# EAGLE design MOSFET_Board (EAGLE 9.1.3)

## Sheet 1 of 4
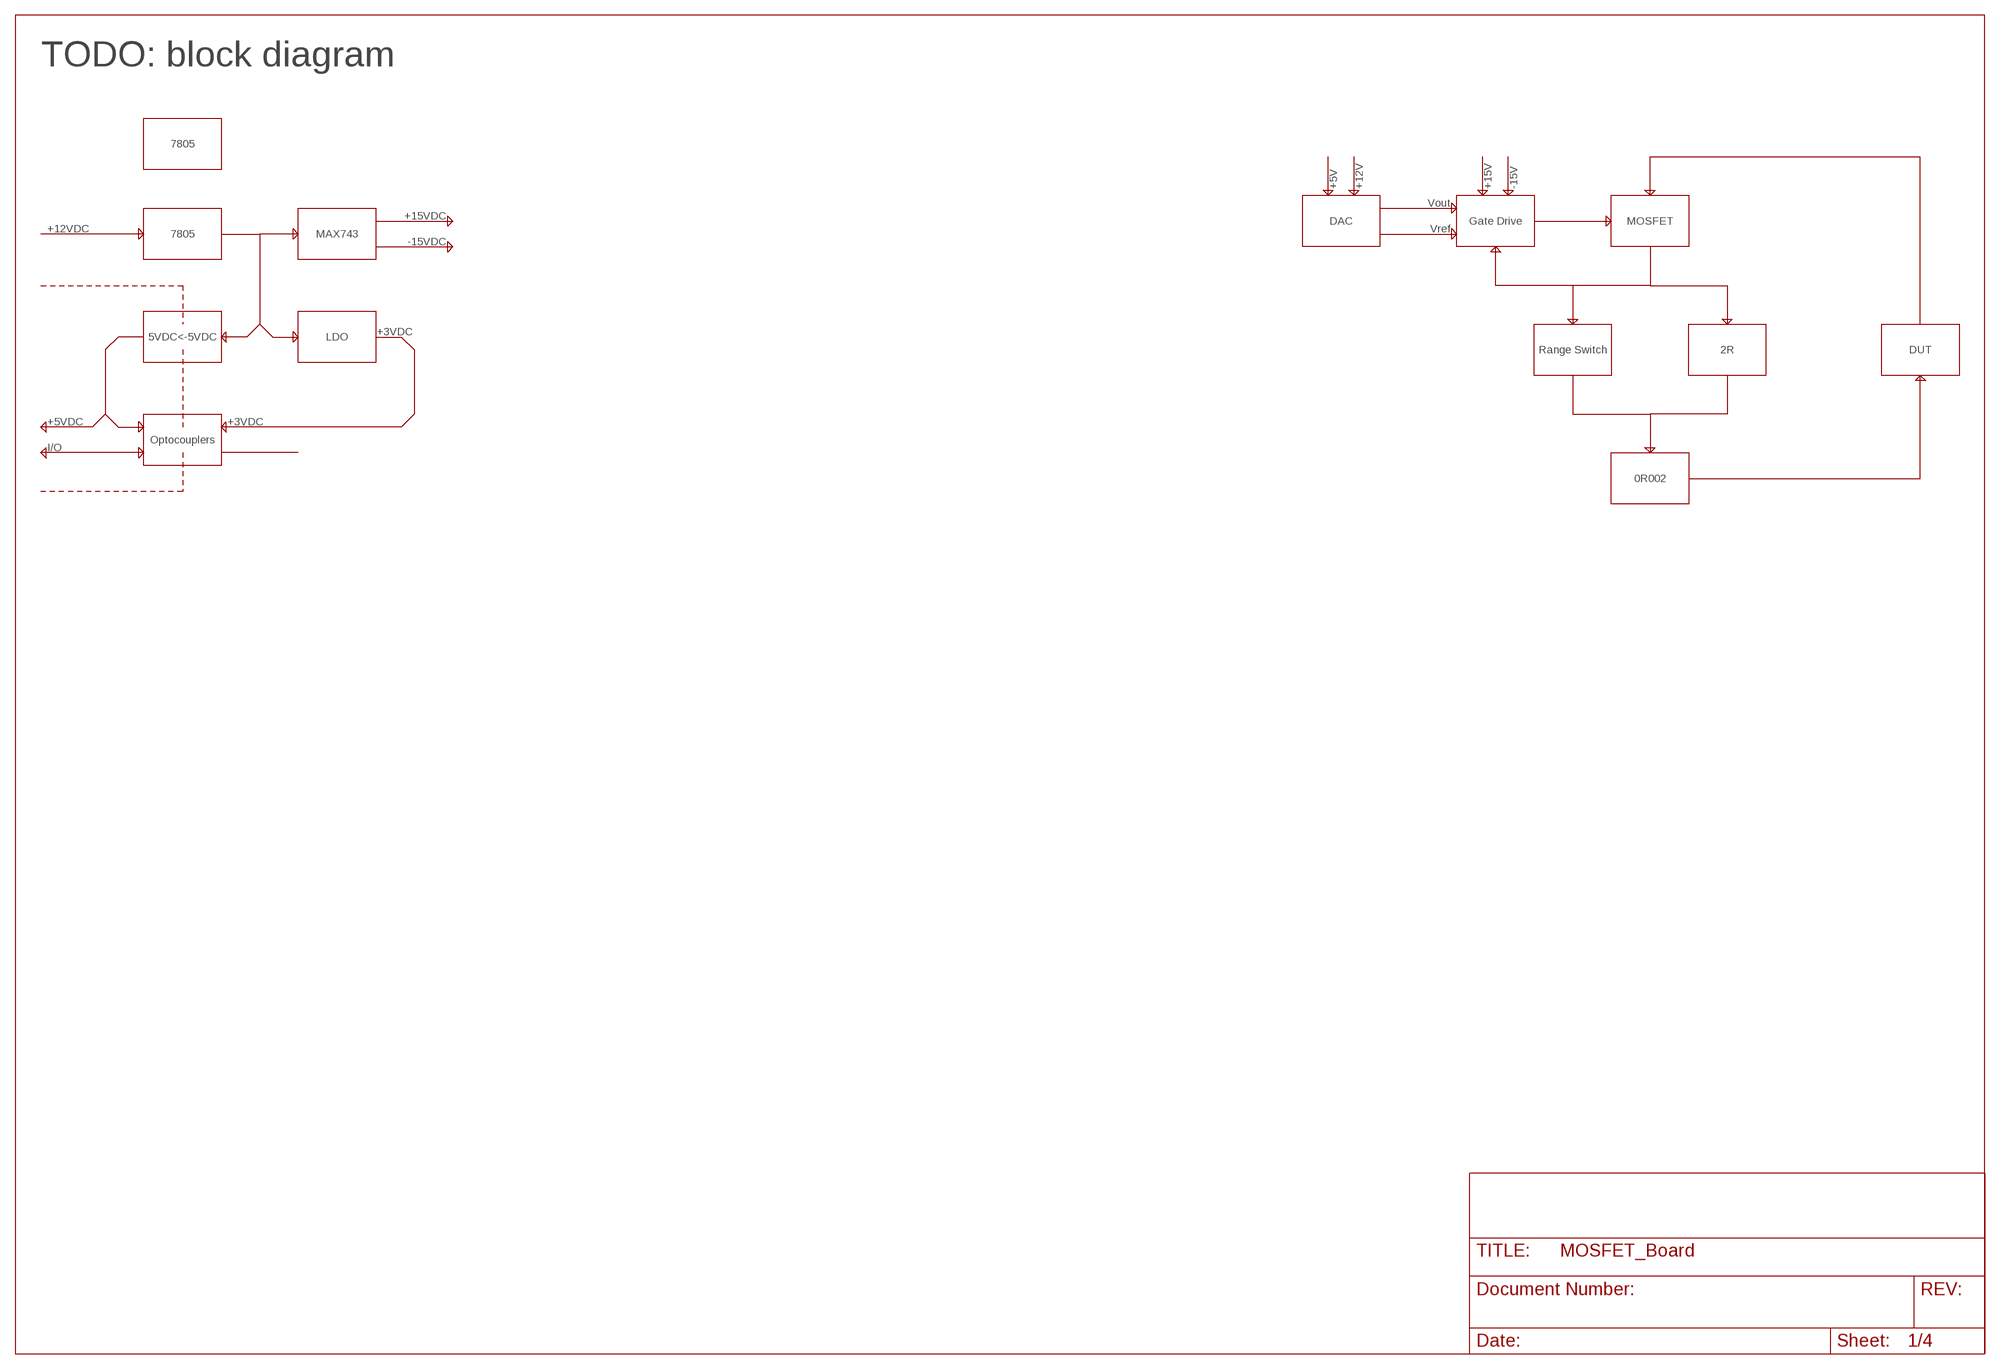
[diagram p0: schematic, sheet 1]

### Notes on the sheet
- TODO: block diagram
- 7805
- +5V | +12V | +15V | -15V
- Vout
- +15VDC | DAC | Gate Drive | MOSFET
- +12VDC | 7805 | MAX743 | Vref
- -15VDC
- 5VDC<-5VDC | LDO | +3VDC
- Range Switch | 2R | DUT
- +5VDC | +3VDC
- Optocouplers
- I/O
- 0R002

## Sheet 2 of 4
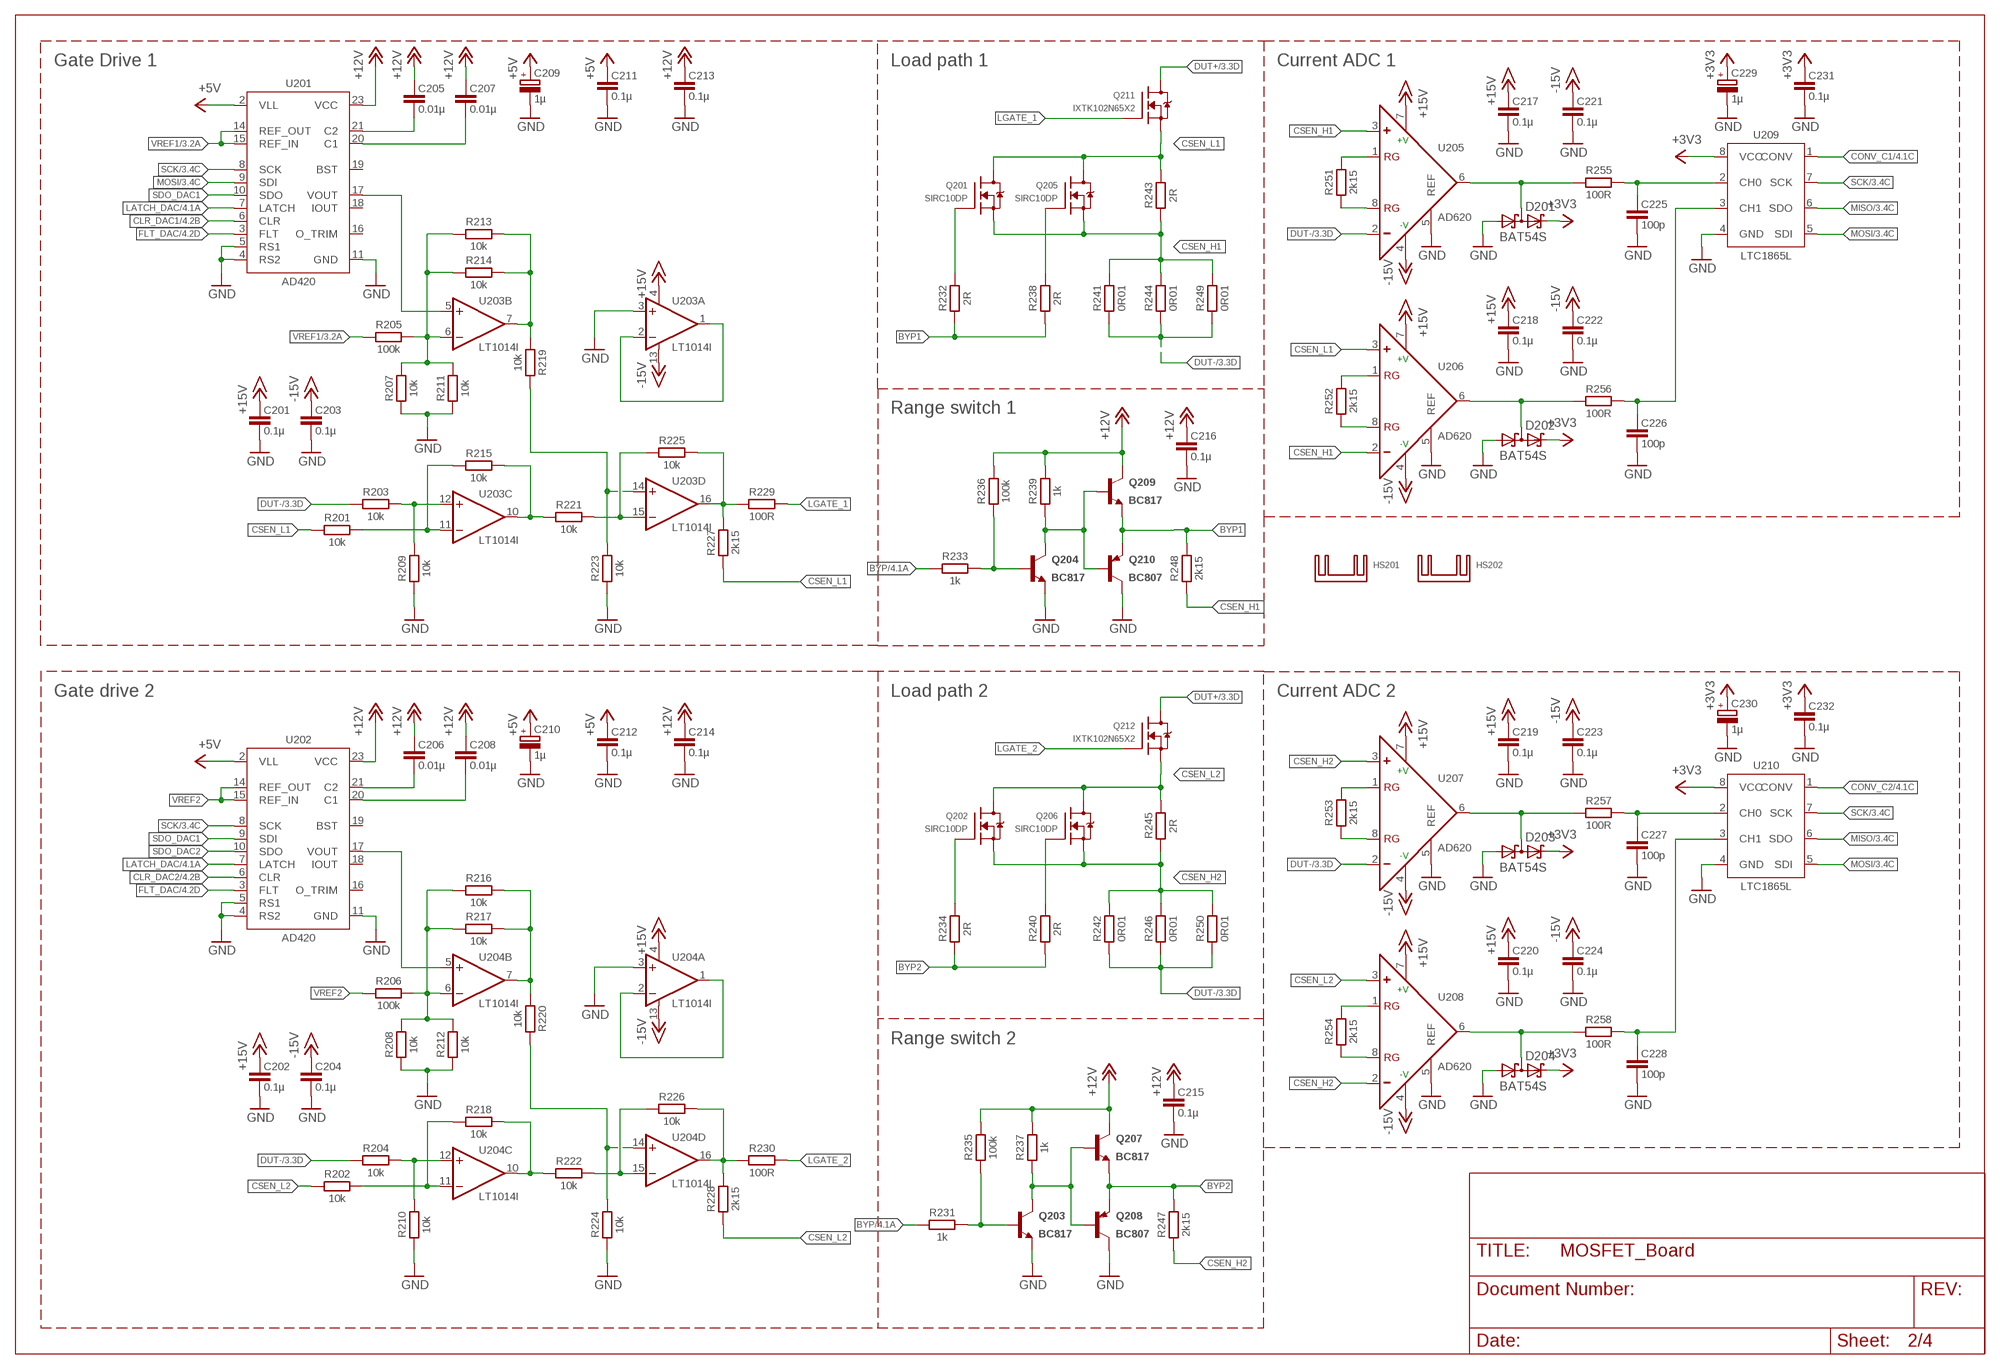
[diagram p1: schematic, sheet 2]

### Parts
C201  0.1µ  C-EU-1608  [C1608]
C202  0.1µ  C-EU-1608  [C1608]
C203  0.1µ  C-EU-1608  [C1608]
C204  0.1µ  C-EU-1608  [C1608]
C205  0.01µ  C-EU-2012  [C2012]
C206  0.01µ  C-EU-3216  [C3216]
C207  0.01µ  C-EU-2012  [C2012]
C208  0.01µ  C-EU-3216  [C3216]
C209  1µ  CPOL-3216-A  [CT3216]
C210  1µ  CPOL-3216-A  [CT3216]
C211  0.1µ  C-EU-1608  [C1608]
C212  0.1µ  C-EU-1608  [C1608]
C213  0.1µ  C-EU-1608  [C1608]
C214  0.1µ  C-EU-1608  [C1608]
C215  0.1µ  C-EU-1608  [C1608]
C216  0.1µ  C-EU-1608  [C1608]
C217  0.1µ  C-EU-1608  [C1608]
C218  0.1µ  C-EU-1608  [C1608]
C219  0.1µ  C-EU-1608  [C1608]
C220  0.1µ  C-EU-1608  [C1608]
C221  0.1µ  C-EU-1608  [C1608]
C222  0.1µ  C-EU-1608  [C1608]
C223  0.1µ  C-EU-1608  [C1608]
C224  0.1µ  C-EU-1608  [C1608]
C225  100p  C-EU-1608  [C1608]
C226  100p  C-EU-1608  [C1608]
C227  100p  C-EU-1608  [C1608]
C228  100p  C-EU-1608  [C1608]
C229  1µ  CPOL-3216-A  [CT3216]
C230  1µ  CPOL-3216-A  [CT3216]
C231  0.1µ  C-EU-1608  [C1608]
C232  0.1µ  C-EU-1608  [C1608]
D201  BAT54S  [SOT23]
D202  BAT54S  [SOT23]
D203  BAT54S  [SOT23]
D204  BAT54S  [SOT23]
HS201  HEATSINK-LGA115X  [HEATSINK-LGA115X]
HS202  HEATSINK-LGA115X  [HEATSINK-LGA115X]
Q201  SIRC10DP  [POWERPAK-SO-8]
Q202  SIRC10DP  [POWERPAK-SO-8]
Q203  BC817  [SOT23]
Q204  BC817  [SOT23]
Q205  SIRC10DP  [POWERPAK-SO-8]
Q206  SIRC10DP  [POWERPAK-SO-8]
Q207  BC817  [SOT23]
Q208  BC807  [SOT23]
Q209  BC817  [SOT23]
Q210  BC807  [SOT23]
Q211  IXTK102N65X2  IXTK102N65X2R  [TO-264P-H-PADUP]
Q212  IXTK102N65X2  IXTK102N65X2R  [TO-264P-H-PADUP]
R201  10k  R-EU-1608  [R1608]
R202  10k  R-EU-1608  [R1608]
R203  10k  R-EU-1608  [R1608]
R204  10k  R-EU-1608  [R1608]
R205  100k  R-EU-1608  [R1608]
R206  100k  R-EU-1608  [R1608]
R207  10k  R-EU-1608  [R1608]
R208  10k  R-EU-1608  [R1608]
R209  10k  R-EU-1608  [R1608]
R210  10k  R-EU-1608  [R1608]
R211  10k  R-EU-1608  [R1608]
R212  10k  R-EU-1608  [R1608]
R213  10k  R-EU-1608  [R1608]
R214  10k  R-EU-1608  [R1608]
R215  10k  R-EU-1608  [R1608]
R216  10k  R-EU-1608  [R1608]
R217  10k  R-EU-1608  [R1608]
R218  10k  R-EU-1608  [R1608]
R219  10k  R-EU-1608  [R1608]
R220  10k  R-EU-1608  [R1608]
R221  10k  R-EU-1608  [R1608]
R222  10k  R-EU-1608  [R1608]
R223  10k  R-EU-1608  [R1608]
R224  10k  R-EU-1608  [R1608]
R225  10k  R-EU-1608  [R1608]
R226  10k  R-EU-1608  [R1608]
R227  2k15  R-EU-2012  [R2012W]
R228  2k15  R-EU-2012  [R2012W]
R229  100R  R-EU-2012  [R2012W]
R230  100R  R-EU-2012  [R2012W]
R231  1k  R-EU-1608  [R1608]
R232  2R  R-EU-3216  [R3216W]
R233  1k  R-EU-1608  [R1608]
R234  2R  R-EU-3216  [R3216W]
R235  100k  R-EU-1608  [R1608]
R236  100k  R-EU-1608  [R1608]
R237  1k  R-EU-1608  [R1608]
R238  2R  R-EU-3216  [R3216W]
R239  1k  R-EU-1608  [R1608]
R240  2R  R-EU-3216  [R3216W]
R241  0R01  R-EU-6332  [R6332W]
R242  0R01  R-EU-6332  [R6332W]
R243  2R  R-EU-3216  [R3216W]
R244  0R01  R-EU-6332  [R6332W]
R245  2R  R-EU-3216  [R3216W]
R246  0R01  R-EU-6332  [R6332W]
R247  2k15  R-EU-2012  [R2012W]
R248  2k15  R-EU-2012  [R2012W]
R249  0R01  R-EU-6332  [R6332W]
R250  0R01  R-EU-6332  [R6332W]
R251  2k15  R-EU-2012  [R2012W]
R252  2k15  R-EU-2012  [R2012W]
R253  2k15  R-EU-2012  [R2012W]
R254  2k15  R-EU-2012  [R2012W]
R255  100R  R-EU-2012  [R2012W]
R256  100R  R-EU-2012  [R2012W]
R257  100R  R-EU-2012  [R2012W]
R258  100R  R-EU-2012  [R2012W]
U201  AD420  AD420RW-24  [SO24W]
U202  AD420  AD420RW-24  [SO24W]
U203  LT1014I  LT1014ISW  [SO16W]
U204  LT1014I  LT1014ISW  [SO16W]
U205  AD620  AD620R-8  [SO8]
U206  AD620  AD620R-8  [SO8]
U207  AD620  AD620R-8  [SO8]
U208  AD620  AD620R-8  [SO8]
U209  LTC1865L  [SO8]
U210  LTC1865L  [SO8]

### Nets
+3V3: C229.+ C230.+ C231.1 C232.1 D201.2(C2) D202.2(C2) D203.2(C2) D204.2(C2) U209.8(VCC) U210.8(VCC) ; also sheet 3,4
+5V: C209.+ C210.+ C211.1 C212.1 U201.2(VLL) U202.2(VLL) ; also sheet 3,4
+12V: C205.1 C206.1 C207.1 C208.1 C213.1 C214.1 C215.1 C216.1 Q207.3(C) Q209.3(C) R235.2 R236.2 R237.2 R239.2 U201.23(VCC) U202.23(VCC) ; also sheet 3
+15V: C201.1 C202.1 C217.1 C218.1 C219.1 C220.1 U203.4(A:V+) U204.4(A:V+) U205.7(+V) U206.7(+V) U207.7(+V) U208.7(+V) ; also sheet 3
-15V: C203.1 C204.1 C221.1 C222.1 C223.1 C224.1 U203.13(A:V-) U204.13(A:V-) U205.4(-V) U206.4(-V) U207.4(-V) U208.4(-V) ; also sheet 3
BPY1G1: Q201.4(G) R232.2
BYP: R231.1 R233.1 ; also sheet 4
BYP1: Q209.2(E) Q210.2(E) R232.1 R238.1 R248.1
BYP1G2: Q205.4(G) R238.2
BYP2: Q207.2(E) Q208.2(E) R234.1 R240.1 R247.2
BYP2G1: Q202.4(G) R234.2
BYP2G2: Q206.4(G) R240.2
CLR_DAC1: U201.6(CLR) ; also sheet 4
CLR_DAC2: U202.6(CLR) ; also sheet 4
CONV_C1: U209.1(CONV) ; also sheet 4
CONV_C2: U210.1(CONV) ; also sheet 4
CSEN_H1: Q201.1(S) Q201.2(S) Q201.3(S) Q205.1(S) Q205.2(S) Q205.3(S) R241.2 R243.1 R244.2 R248.2 R249.2 U205.3(+) U206.2(-)
CSEN_H2: Q202.1(S) Q202.2(S) Q202.3(S) Q206.1(S) Q206.2(S) Q206.3(S) R242.2 R245.1 R246.2 R247.1 R250.2 U207.3(+) U208.2(-)
CSEN_L1: Q201.5(D) Q205.5(D) Q211.1(S) R201.1 R227.1 R243.2 U206.3(+)
CSEN_L2: Q202.5(D) Q206.5(D) Q212.1(S) R202.1 R228.1 R245.2 U208.3(+)
DAC_VOUT: U201.17(VOUT) U203.5(B:+IN)
DAC_VOUT1: U202.17(VOUT) U204.5(B:+IN)
DUT+ [DUT+]: Q211.2(D) Q212.2(D) ; also sheet 3
DUT- [DUT-]: R203.1 R204.1 R241.1 R242.1 R244.1 R246.1 R249.1 R250.1 U205.2(-) U207.2(-) ; also sheet 3
FLT_DAC: U201.3(FLT) U202.3(FLT) ; also sheet 4
GND: C201.2 C202.2 C203.2 C204.2 C209.- C210.- C211.2 C212.2 C213.2 C214.2 C215.2 C216.2 C217.2 C218.2 C219.2 C220.2 C221.2 C222.2 C223.2 C224.2 C225.2 C226.2 C227.2 C228.2 C229.- C230.- C231.2 C232.2 D201.1(A1) D202.1(A1) D203.1(A1) D204.1(A1) Q203.2(E) Q204.2(E) Q208.3(C) Q210.3(C) R207.1 R208.1 R209.1 R210.1 R211.1 R212.1 R223.1 R224.1 U201.4(RS2) U201.5(RS1) U201.11(GND) U202.4(RS2) U202.5(RS1) U202.11(GND) U203.3(A:+IN) U204.3(A:+IN) U205.5(REF) U206.5(REF) U207.5(REF) U208.5(REF) U209.4(GND) U210.4(GND) ; also sheet 3,4
HIGHC1: C225.1 R255.2 U209.2(CH0)
HIGHC2: C227.1 R257.2 U210.2(CH0)
LATCH_DAC: U201.7(LATCH) U202.7(LATCH) ; also sheet 4
LGATE_1: Q211.3(G) R229.2
LGATE_2: Q212.3(G) R230.2
LOWC1: C226.1 R256.2 U209.3(CH1)
LOWC2: C228.1 R258.2 U210.3(CH1)
MISO: U209.6(SDO) U210.6(SDO) ; also sheet 3,4
MOSI: U201.9(SDI) U209.5(SDI) U210.5(SDI) ; also sheet 3,4
N$1: R203.2 R209.2 U203.12(C:+IN)
N$2: R221.2 R225.1 U203.15(D:-IN)
N$3: C205.2 U201.21(C2)
N$4: C207.2 U201.20(C1)
N$5: Q204.3(C) Q209.1(B) Q210.1(B) R239.1
N$6: R225.2 R227.2 R229.1 U203.16(D:OUT)
N$7: D201.3(C1A2) R255.1 U205.6(OUT)
N$8: Q204.1(B) R233.2 R236.1
N$9: R219.2 R223.2 U203.14(D:+IN)
N$11: R213.2 R214.2 R219.1 U203.7(B:OUT)
N$12: R205.2 R207.2 R211.2 R213.1 R214.1 U203.6(B:-IN)
N$13: R215.2 R221.1 U203.10(C:OUT)
N$14: R201.2 R215.1 U203.11(C:-IN)
N$15: U203.1(A:OUT) U203.2(A:-IN)
N$16: D202.3(C1A2) R256.1 U206.6(OUT)
N$25: Q203.3(C) Q207.1(B) Q208.1(B) R237.1
N$31: Q203.1(B) R231.2 R235.1
N$41: C206.2 U202.21(C2)
N$42: C208.2 U202.20(C1)
N$43: R206.2 R208.2 R212.2 R216.1 R217.1 U204.6(B:-IN)
N$44: R218.2 R222.1 U204.10(C:OUT)
N$49: R202.2 R218.1 U204.11(C:-IN)
N$50: R204.2 R210.2 U204.12(C:+IN)
N$51: R222.2 R226.1 U204.15(D:-IN)
N$52: R226.2 R228.2 R230.1 U204.16(D:OUT)
N$53: R220.2 R224.2 U204.14(D:+IN)
N$54: R216.2 R217.2 R220.1 U204.7(B:OUT)
N$55: U204.1(A:OUT) U204.2(A:-IN)
N$56: D203.3(C1A2) R257.1 U207.6(OUT)
N$57: D204.3(C1A2) R258.1 U208.6(OUT)
RG1_L1: R253.2 U207.1(RG)
RG1_L2: R254.2 U208.1(RG)
RG1_L3: R251.2 U205.1(RG)
RG1_L4: R252.2 U206.1(RG)
RG2_L1: R253.1 U207.8(RG)
RG2_L2: R254.1 U208.8(RG)
RG2_L3: R251.1 U205.8(RG)
RG2_L4: R252.1 U206.8(RG)
SCK: U201.8(SCK) U202.8(SCK) U209.7(SCK) U210.7(SCK) ; also sheet 3,4
SDO_DAC1: U201.10(SDO) U202.9(SDI)
SDO_DAC2: U202.10(SDO)
VREF1: R205.1 U201.14(REF_OUT) U201.15(REF_IN) ; also sheet 3
VREF2: R206.1 U202.14(REF_OUT) U202.15(REF_IN)
Unconnected: U201.16(O_TRIM) U201.18(IOUT) U201.19(BST) U202.16(O_TRIM) U202.18(IOUT) U202.19(BST)

### Notes on the sheet
- Gate Drive 1 | Load path 1 | Current ADC 1
- Range switch 1
- Gate drive 2 | Load path 2 | Current ADC 2
- Range switch 2

## Sheet 3 of 4
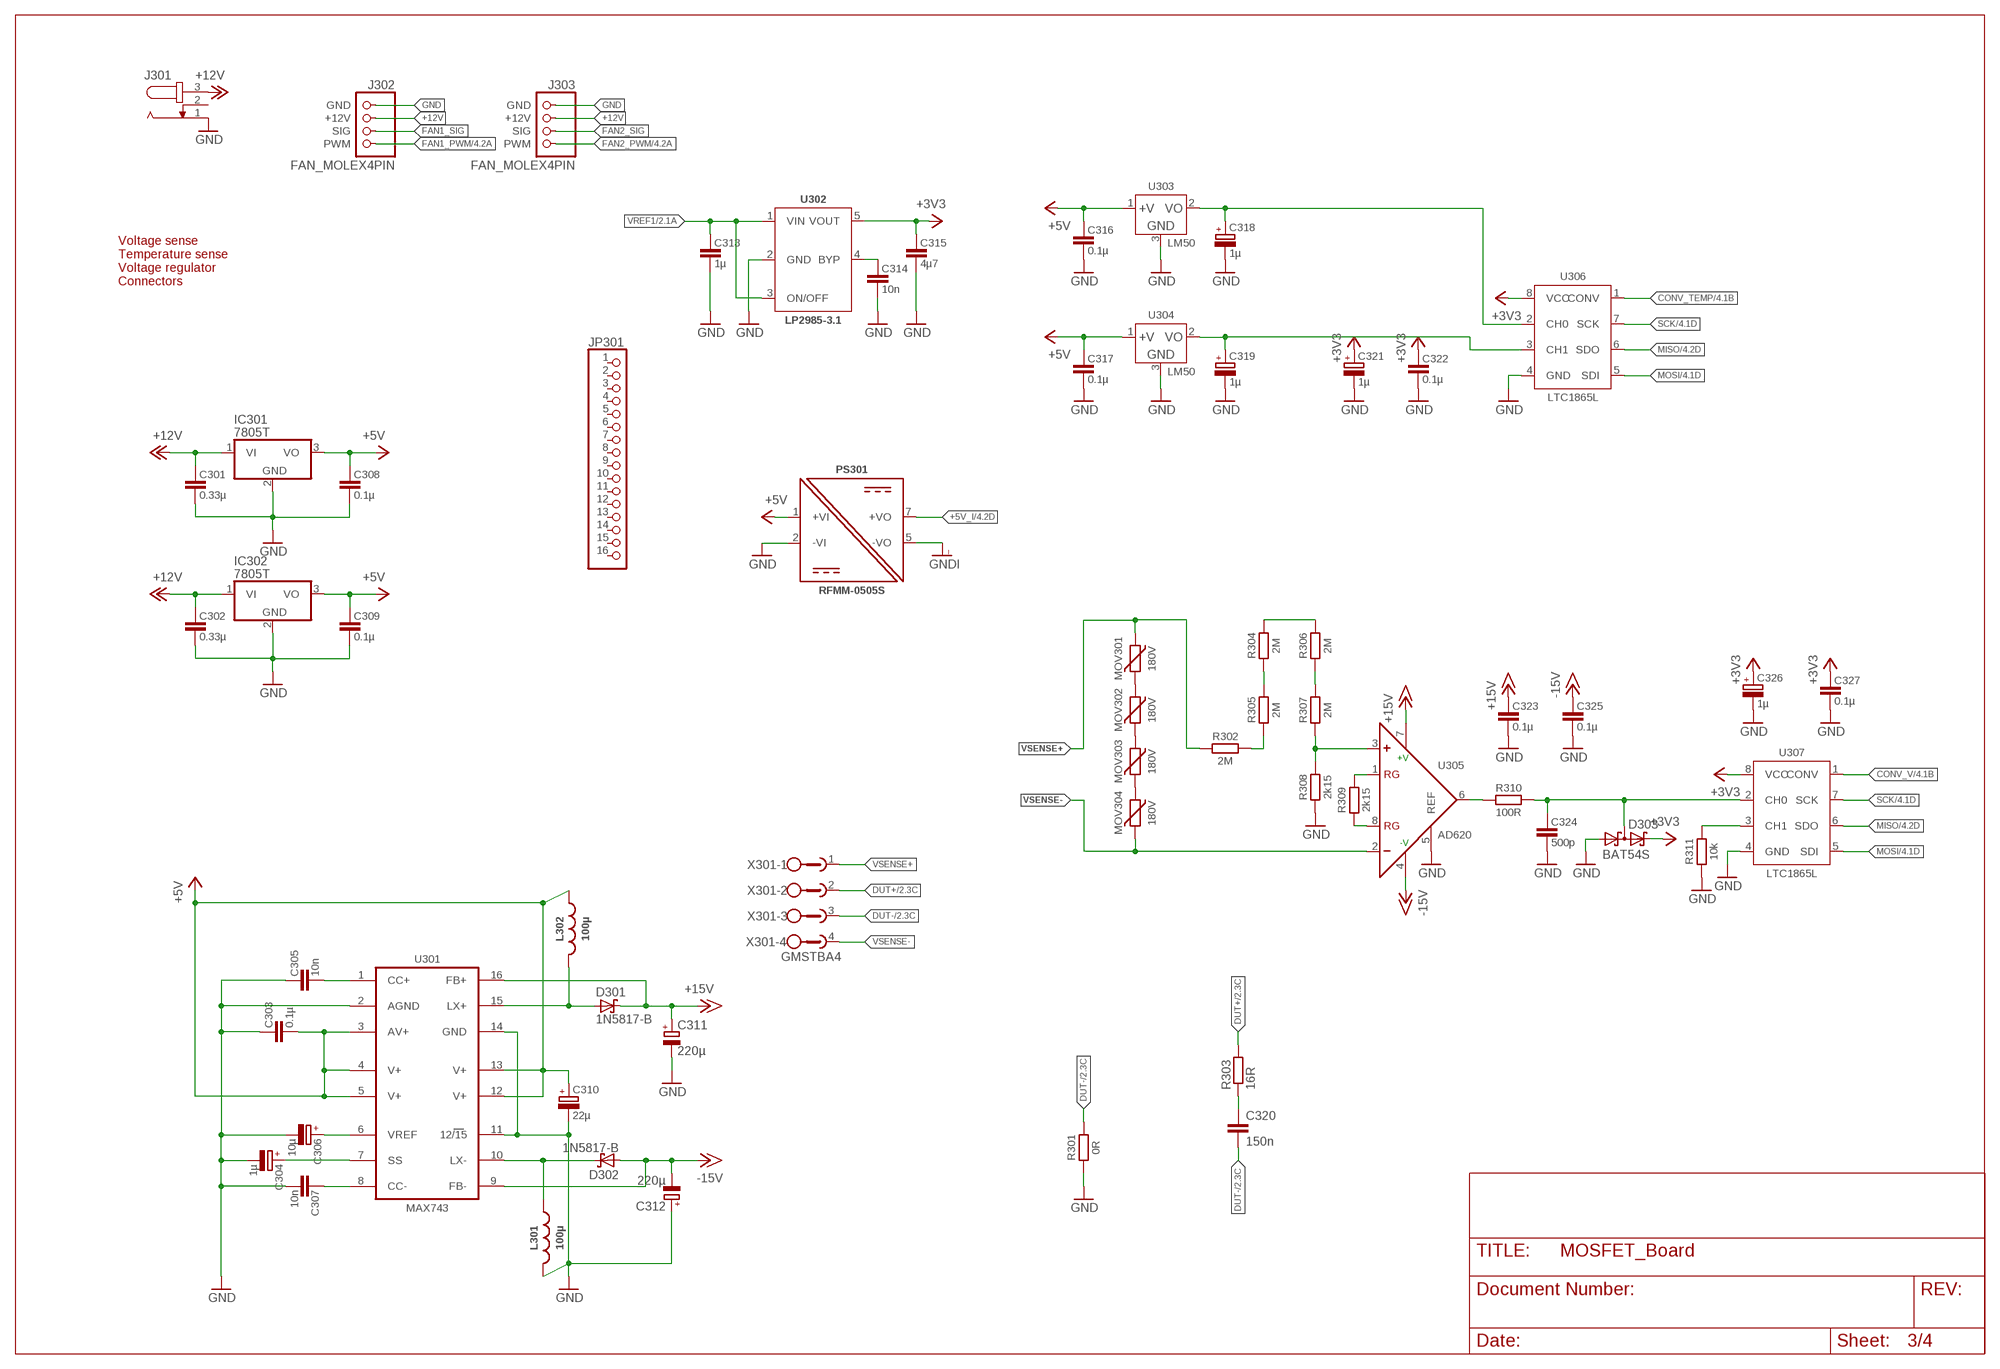
[diagram p2: schematic, sheet 3]

### Parts
C301  0.33µ  C-EU-3216  [C3216]
C302  0.33µ  C-EU-3216  [C3216]
C303  0.1µ  C-EU-3216  [C3216]
C304  1µ  CPOL-3216-A  [CT3216]
C305  10n  C-EU-2012  [C2012]
C306  10µ  CPOL-6032-C  [CT6032]
C307  10n  C-EU-2012  [C2012]
C308  0.1µ  C-EU-1608  [C1608]
C309  0.1µ  C-EU-1608  [C1608]
C310  22µ  CPOL-6032-C  [CT6032]
C311  220µ  CPOL-EUE3.5-10  [E3,5-10]
C312  220µ  CPOL-EUE3.5-10  [E3,5-10]
C313  1µ  C-EU-3216  [C3216]
C314  10n  C-EU-2012  [C2012]
C315  4µ7  C-EU-3216  [C3216]
C316  0.1µ  C-EU-3216  [C3216]
C317  0.1µ  C-EU-3216  [C3216]
C318  1µ  CPOL-3216-A  [CT3216]
C319  1µ  CPOL-3216-A  [CT3216]
C320  150n  C-EU050-030X075  [C050-030X075]
C321  1µ  CPOL-3216-A  [CT3216]
C322  0.1µ  C-EU-3216  [C3216]
C323  0.1µ  C-EU-3216  [C3216]
C324  500p  C-EU-1608  [C1608]
C325  0.1µ  C-EU-3216  [C3216]
C326  1µ  CPOL-3216-A  [CT3216]
C327  0.1µ  C-EU-3216  [C3216]
D301  1N5817-B  [DO41-7.6]
D302  1N5817-B  [DO41-7.6]
D303  BAT54S  [SOT23]
IC301  7805T  [TO220H]
IC302  7805T  [TO220H]
J301  JACK-PLUG1  [SPC4078]
J302  FAN_MOLEX4PIN  [MOLEX_47053-1000]
J303  FAN_MOLEX4PIN  [MOLEX_47053-1000]
JP301  PINHD-1X16  [1X16]
L301  100µ  L-EU_MSS1260  [MSS1260]
L302  100µ  L-EU_MSS1260  [MSS1260]
MOV301  180V  MOV-3225  [R3225W]
MOV302  180V  MOV-3225  [R3225W]
MOV303  180V  MOV-3225  [R3225W]
MOV304  180V  MOV-3225  [R3225W]
PS301  RFMM-0505S  [RECOM-SIP7]
R301  0R  R-EU-3216  [R3216W]
R302  2M  R-EU-3216  [R3216W]
R303  16R  R-EU_0204/7  [0204/7]
R304  2M  R-EU-3216  [R3216W]
R305  2M  R-EU-3216  [R3216W]
R306  2M  R-EU-3216  [R3216W]
R307  2M  R-EU-3216  [R3216W]
R308  2k15  R-EU-2012  [R2012W]
R309  2k15  R-EU-2012  [R2012W]
R310  100R  R-EU-2012  [R2012W]
R311  10k  R-EU-1608  [R1608]
U301  MAX743  MAX743WE  [SO16W]
U302  LP2985-3.1  [SOT23-5L]
U303  LM50  [SOT23W]
U304  LM50  [SOT23W]
U305  AD620  AD620R-8  [SO8]
U306  LTC1865L  [SO8]
U307  LTC1865L  [SO8]
X301  GMSTBA4  [GMSTBA4]

### Nets
+3V3: C315.1 C321.+ C322.1 C326.+ C327.1 D303.2(C2) U302.5(VOUT) U306.8(VCC) U307.8(VCC) ; also sheet 2,4
+5V: C303.2 C308.1 C309.1 C310.+ C316.1 C317.1 IC301.3(VO) IC302.3(VO) L302.1 PS301.1(+VI) U301.3(AV+) U301.4(V+) U301.5(V+) U301.12(V+) U301.13(V+) U303.1(+V) U304.1(+V) ; also sheet 2,4
+5V_I [default_iso]: PS301.7(+VO) ; also sheet 4
+12V: C301.1 C302.1 IC301.1(VI) IC302.1(VI) J301.3 J302.2(+12V) J303.2(+12V) ; also sheet 2
+15V: C311.+ C323.1 D301.C U301.16(FB+) U305.7(+V) ; also sheet 2
-15V: C312.- C325.1 D302.A U301.9(FB-) U305.4(-V) ; also sheet 2
CONV_TEMP: U306.1(CONV) ; also sheet 4
CONV_V: U307.1(CONV) ; also sheet 4
DUT+ [DUT+]: R303.2 X301.2 ; also sheet 2
DUT- [DUT-]: C320.2 R301.2 X301.3 ; also sheet 2
FAN1_PWM: J302.4(PWM) ; also sheet 4
FAN1_SIG: J302.3(SIG)
FAN2_PWM: J303.4(PWM) ; also sheet 4
FAN2_SIG: J303.3(SIG)
GND: C301.2 C302.2 C303.1 C304.- C305.1 C306.- C307.2 C308.2 C309.2 C310.- C311.- C312.+ C313.2 C314.2 C315.2 C316.2 C317.2 C318.- C319.- C321.- C322.2 C323.2 C324.2 C325.2 C326.- C327.2 D303.1(A1) IC301.2(GND) IC302.2(GND) J301.1 J302.1(GND) J303.1(GND) L301.2 PS301.2(-VI) R301.1 R308.1 R311.1 U301.2(AGND) U301.11(12/15) U301.14(GND) U302.2(GND) U303.3(GND) U304.3(GND) U305.5(REF) U306.4(GND) U307.4(GND) ; also sheet 2,4
GNDI [default_iso]: PS301.5(-VO) ; also sheet 4
MISO: U306.6(SDO) U307.6(SDO) ; also sheet 2,4
MOSI: U306.5(SDI) U307.5(SDI) ; also sheet 2,4
N$10: C314.1 U302.4(BYP)
N$23: R310.1 U305.6(OUT)
N$24: R306.1 R307.2
N$26: R304.2 R306.2
N$27: R304.1 R305.2
N$28: MOV301.2 MOV302.1
N$29: R307.1 R308.2 U305.3(+)
N$30: C324.1 D303.3(C1A2) R310.2 U307.2(CH0)
N$32: MOV302.2 MOV303.1
N$33: R302.2 R305.1
N$34: C307.1 U301.8(CC-)
N$35: C304.+ U301.7(SS)
N$36: MOV303.2 MOV304.1
N$37: C305.2 U301.1(CC+)
N$38: D301.A L302.2 U301.15(LX+)
N$39: D302.C L301.1 U301.10(LX-)
N$45: R311.2 U307.3(CH1)
N$61: C320.1 R303.1
RG1_H6: R309.2 U305.1(RG)
RG2_H6: R309.1 U305.8(RG)
SCK: U306.7(SCK) U307.7(SCK) ; also sheet 2,4
TEMP1: C318.+ U303.2(VO) U306.2(CH0)
TEMP2: C319.+ U304.2(VO) U306.3(CH1)
VREF1: C313.1 U302.1(VIN) U302.3(ON/OFF) ; also sheet 2
VREF_MAX743: C306.+ U301.6(VREF)
VSENSE+ [VSENSE+]: MOV301.1 R302.1 X301.1
VSENSE- [VSENSE-]: MOV304.2 U305.2(-) X301.4
Unconnected: J301.2 JP301.1 JP301.2 JP301.3 JP301.4 JP301.5 JP301.6 JP301.7 JP301.8 JP301.9 JP301.10 JP301.11 JP301.12 JP301.13 JP301.14 JP301.15 JP301.16

### Notes on the sheet
- Voltage sense
  Temperature sense
  Voltage regulator
  Connectors

## Sheet 4 of 4
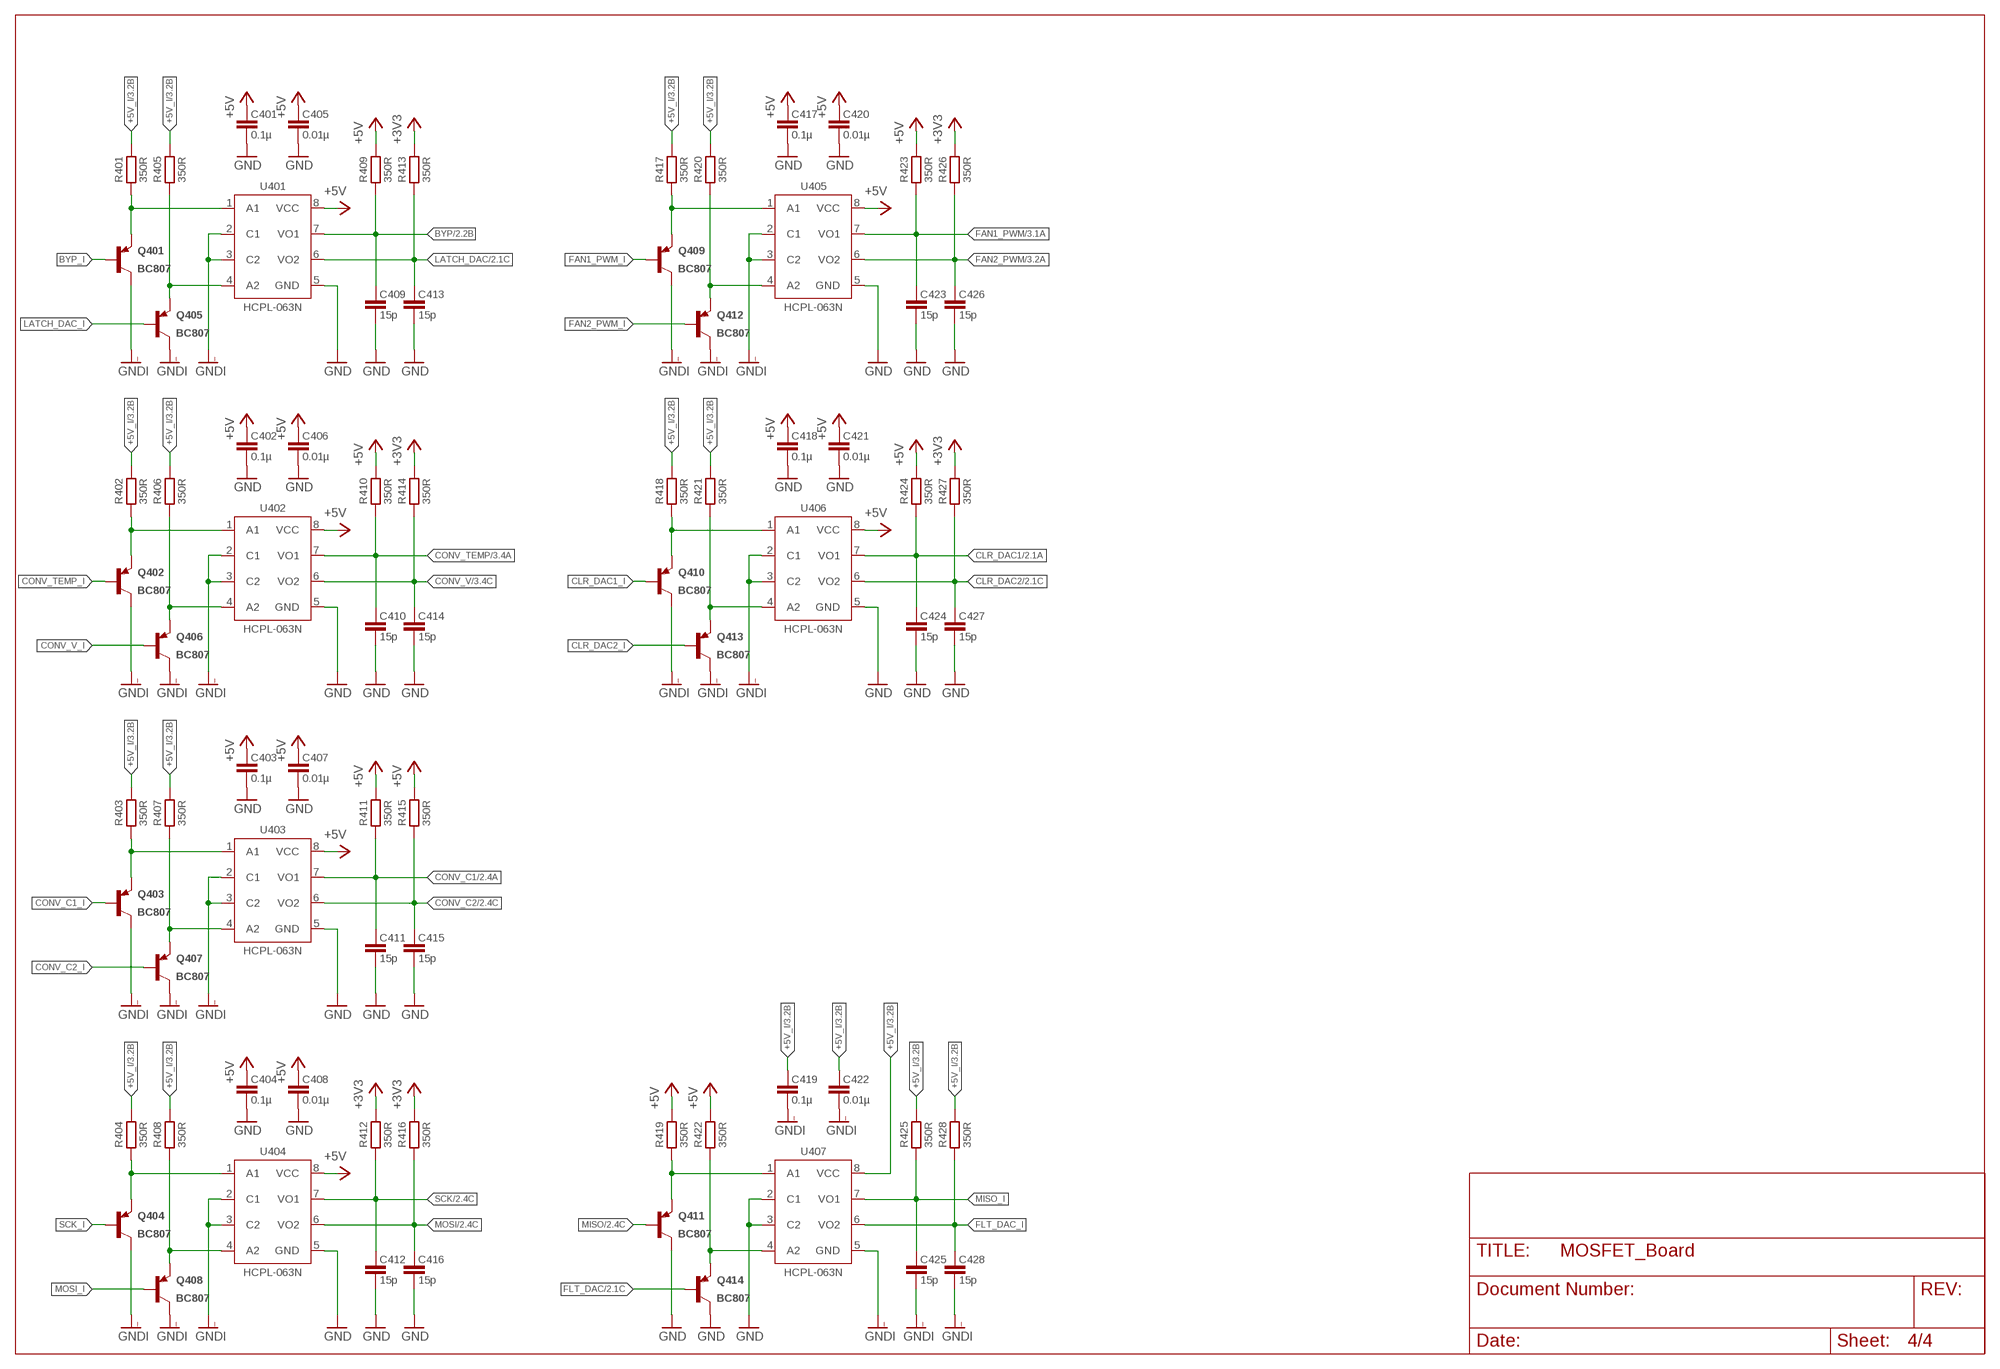
[diagram p3: schematic, sheet 4]

### Parts
C401  0.1µ  C-EU-1608  [C1608]
C402  0.1µ  C-EU-1608  [C1608]
C403  0.1µ  C-EU-1608  [C1608]
C404  0.1µ  C-EU-1608  [C1608]
C405  0.01µ  C-EU-3216  [C3216]
C406  0.01µ  C-EU-3216  [C3216]
C407  0.01µ  C-EU-3216  [C3216]
C408  0.01µ  C-EU-3216  [C3216]
C409  15p  C-EU-1608  [C1608]
C410  15p  C-EU-1608  [C1608]
C411  15p  C-EU-1608  [C1608]
C412  15p  C-EU-1608  [C1608]
C413  15p  C-EU-1608  [C1608]
C414  15p  C-EU-1608  [C1608]
C415  15p  C-EU-1608  [C1608]
C416  15p  C-EU-1608  [C1608]
C417  0.1µ  C-EU-1608  [C1608]
C418  0.1µ  C-EU-1608  [C1608]
C419  0.1µ  C-EU-1608  [C1608]
C420  0.01µ  C-EU-3216  [C3216]
C421  0.01µ  C-EU-3216  [C3216]
C422  0.01µ  C-EU-3216  [C3216]
C423  15p  C-EU-1608  [C1608]
C424  15p  C-EU-1608  [C1608]
C425  15p  C-EU-1608  [C1608]
C426  15p  C-EU-1608  [C1608]
C427  15p  C-EU-1608  [C1608]
C428  15p  C-EU-1608  [C1608]
Q401  BC807  [SOT23]
Q402  BC807  [SOT23]
Q403  BC807  [SOT23]
Q404  BC807  [SOT23]
Q405  BC807  [SOT23]
Q406  BC807  [SOT23]
Q407  BC807  [SOT23]
Q408  BC807  [SOT23]
Q409  BC807  [SOT23]
Q410  BC807  [SOT23]
Q411  BC807  [SOT23]
Q412  BC807  [SOT23]
Q413  BC807  [SOT23]
Q414  BC807  [SOT23]
R401  350R  R-EU-1608  [R1608]
R402  350R  R-EU-1608  [R1608]
R403  350R  R-EU-1608  [R1608]
R404  350R  R-EU-1608  [R1608]
R405  350R  R-EU-1608  [R1608]
R406  350R  R-EU-1608  [R1608]
R407  350R  R-EU-1608  [R1608]
R408  350R  R-EU-1608  [R1608]
R409  350R  R-EU-1608  [R1608]
R410  350R  R-EU-1608  [R1608]
R411  350R  R-EU-1608  [R1608]
R412  350R  R-EU-1608  [R1608]
R413  350R  R-EU-1608  [R1608]
R414  350R  R-EU-1608  [R1608]
R415  350R  R-EU-1608  [R1608]
R416  350R  R-EU-1608  [R1608]
R417  350R  R-EU-1608  [R1608]
R418  350R  R-EU-1608  [R1608]
R419  350R  R-EU-1608  [R1608]
R420  350R  R-EU-1608  [R1608]
R421  350R  R-EU-1608  [R1608]
R422  350R  R-EU-1608  [R1608]
R423  350R  R-EU-1608  [R1608]
R424  350R  R-EU-1608  [R1608]
R425  350R  R-EU-1608  [R1608]
R426  350R  R-EU-1608  [R1608]
R427  350R  R-EU-1608  [R1608]
R428  350R  R-EU-1608  [R1608]
U401  HCPL-063N  [SO8]
U402  HCPL-063N  [SO8]
U403  HCPL-063N  [SO8]
U404  HCPL-063N  [SO8]
U405  HCPL-063N  [SO8]
U406  HCPL-063N  [SO8]
U407  HCPL-063N  [SO8]

### Nets
+3V3: R412.2 R413.2 R414.2 R416.2 R426.2 R427.2 ; also sheet 2,3
+5V: C401.1 C402.1 C403.1 C404.1 C405.1 C406.1 C407.1 C408.1 C417.1 C418.1 C420.1 C421.1 R409.2 R410.2 R411.2 R415.2 R419.2 R422.2 R423.2 R424.2 U401.8(VCC) U402.8(VCC) U403.8(VCC) U404.8(VCC) U405.8(VCC) U406.8(VCC) ; also sheet 2,3
+5V_I [default_iso]: C419.1 C422.1 R401.2 R402.2 R403.2 R404.2 R405.2 R406.2 R407.2 R408.2 R417.2 R418.2 R420.2 R421.2 R425.2 R428.2 U407.8(VCC) ; also sheet 3
BYP: C409.1 R409.1 U401.7(VO1) ; also sheet 2
BYP_I [default_iso]: Q401.1(B)
CLR_DAC1: C424.1 R424.1 U406.7(VO1) ; also sheet 2
CLR_DAC1_I [default_iso]: Q410.1(B)
CLR_DAC2: C427.1 R427.1 U406.6(VO2) ; also sheet 2
CLR_DAC2_I [default_iso]: Q413.1(B)
CONV_C1: C411.1 R411.1 U403.7(VO1) ; also sheet 2
CONV_C1_I [default_iso]: Q403.1(B)
CONV_C2: C415.1 R415.1 U403.6(VO2) ; also sheet 2
CONV_C2_I [default_iso]: Q407.1(B)
CONV_TEMP: C410.1 R410.1 U402.7(VO1) ; also sheet 3
CONV_TEMP_I [default_iso]: Q402.1(B)
CONV_V: C414.1 R414.1 U402.6(VO2) ; also sheet 3
CONV_V_I [default_iso]: Q406.1(B)
FAN1_PWM: C423.1 R423.1 U405.7(VO1) ; also sheet 3
FAN1_PWM_I [default_iso]: Q409.1(B)
FAN2_PWM: C426.1 R426.1 U405.6(VO2) ; also sheet 3
FAN2_PWM_I [default_iso]: Q412.1(B)
FLT_DAC: Q414.1(B) ; also sheet 2
FLT_DAC_I [default_iso]: C428.1 R428.1 U407.6(VO2)
GND: C401.2 C402.2 C403.2 C404.2 C405.2 C406.2 C407.2 C408.2 C409.2 C410.2 C411.2 C412.2 C413.2 C414.2 C415.2 C416.2 C417.2 C418.2 C420.2 C421.2 C423.2 C424.2 C426.2 C427.2 Q411.3(C) Q414.3(C) U401.5(GND) U402.5(GND) U403.5(GND) U404.5(GND) U405.5(GND) U406.5(GND) U407.2(C1) U407.3(C2) ; also sheet 2,3
GNDI [default_iso]: C419.2 C422.2 C425.2 C428.2 Q401.3(C) Q402.3(C) Q403.3(C) Q404.3(C) Q405.3(C) Q406.3(C) Q407.3(C) Q408.3(C) Q409.3(C) Q410.3(C) Q412.3(C) Q413.3(C) U401.2(C1) U401.3(C2) U402.2(C1) U402.3(C2) U403.2(C1) U403.3(C2) U404.2(C1) U404.3(C2) U405.2(C1) U405.3(C2) U406.2(C1) U406.3(C2) U407.5(GND) ; also sheet 3
LATCH_DAC: C413.1 R413.1 U401.6(VO2) ; also sheet 2
LATCH_DAC_I [default_iso]: Q405.1(B)
MISO: Q411.1(B) ; also sheet 2,3
MISO_I [default_iso]: C425.1 R425.1 U407.7(VO1)
MOSI: C416.1 R416.1 U404.6(VO2) ; also sheet 2,3
MOSI_I [default_iso]: Q408.1(B)
N$17: Q411.2(E) R419.1 U407.1(A1)
N$18: Q414.2(E) R422.1 U407.4(A2)
N$19 [default_iso]: Q404.2(E) R404.1 U404.1(A1)
N$20 [default_iso]: Q408.2(E) R408.1 U404.4(A2)
N$21 [default_iso]: Q402.2(E) R402.1 U402.1(A1)
N$22 [default_iso]: Q406.2(E) R406.1 U402.4(A2)
N$40 [default_iso]: Q409.2(E) R417.1 U405.1(A1)
N$46 [default_iso]: Q412.2(E) R420.1 U405.4(A2)
N$47 [default_iso]: Q401.2(E) R401.1 U401.1(A1)
N$48 [default_iso]: Q405.2(E) R405.1 U401.4(A2)
N$58 [default_iso]: Q410.2(E) R418.1 U406.1(A1)
N$59 [default_iso]: Q413.2(E) R421.1 U406.4(A2)
N$76 [default_iso]: Q403.2(E) R403.1 U403.1(A1)
N$77 [default_iso]: Q407.2(E) R407.1 U403.4(A2)
SCK: C412.1 R412.1 U404.7(VO1) ; also sheet 2,3
SCK_I [default_iso]: Q404.1(B)

## Library data of the parts
C201-C208 C211-C228 C231 C232 C301-C303 C305 C307-C309 C313-C317 C322-C325 C327 C401-C428 = passives:C-EU
C209 C210 C229 C230 C304 C306 C310 C318 C319 C321 C326 = passives:CPOL
C311 C312 = rcl:CPOL-EU: POLARIZED CAPACITOR, European symbol; SPICEPREFIX: C
C320 = rcl:C-EU: CAPACITOR, European symbol; SPICEPREFIX: C
D201-D204 D303 = diode:BAT54S: Schottky Diodes Pin connection corrected 2011-05-04 Source: Fairchild .. BAT54.pdf
D301 D302 = diode:1N581*: 1.0A SCHOTTKY BARRIER RECTIFIER Source: http://www.diodes.com/datasheets/ds23001.pdf
HS201 HS202 = mechanical:HEATSINK-LGA115X
IC301 IC302 = linear:78*: Positive VOLTAGE REGULATOR Source: http://cache.national.com/ds/LM/LM78L05.pdf http://www.fairchildsemi.com/ds/LM/LM7805.pdf
J301 = con-jack:JACK-PLUG: DC POWER JACK Power Jack, DC, Right Angle, Through Hole, Rated 5A at 16VDC, PC Terminals Distributor: Farnell (www.Farnell.de) Drawing: 84N1161.pdf / 84N1162.pdf Manufacturer: SPC Technology (www.spctechnology.com) Type: SPC4077 / SPC 4078; OC_FARNELL: unknown; OC_NEWARK: unknown
J302 J303 = mechanical:FAN_MOLEX
JP301 = pinhead:PINHD-1X16: PIN HEADER
L301 L302 = passives:L-EU
MOV301-MOV304 = passives:MOV
PS301 = modules:RFMM-0505S
Q201 Q202 Q205 Q206 = transistors:SIRC10DP
Q203 Q204 Q207 Q209 = transistors:BC817
Q208 Q210 Q401-Q414 = transistors:BC807
Q211 Q212 = transistors:IXTK102N65X2
R201-R258 R301 R302 R304-R311 R401-R428 = passives:R-EU
R303 = rcl:R-EU_: RESISTOR, European symbol; SPICEPREFIX: R
U201 U202 = ic:AD420: The AD420 is a complete digital to current loop output converter, designed to meet the needs of the industrial control market. It provides a high precision, fully integrated, low cost single-chip solution for generating current loop signals in a compact 24-lead SOIC or PDIP package. The output current range can be programmed to 4 mA to 20 mA, 0 mA to 20 mA or to an overrange function of 0 mA to 24 mA. The AD420 can alternatively provide a voltage output from a separate pin that can be configured to provide 0 V to 5 V, 0 V to 10 V, ±5 V, or ±10 V with the addition of a single external buffer amplifier.
U203 U204 = ic:LT1014: The LT ®1014 is the first precision quad operational amplifier which directly upgrades designs in the industry standard 14-pin DIP LM324/LM348/OP-11/4156 pin configuration. It is no longer necessary to compromise specifications, while saving board space and cost, as compared to single operational amplifiers. The LT1014’s low offset voltage of 50µV, drift of 0.3µV/°C, offset current of 0.15nA, gain of 8 million, common mode rejection of 117dB and power supply rejection of 120dB qualify it as four truly precision operational amplifiers. Particularly important is the low offset voltage, since no offset null terminals are provided in the quad configuration. Although supply current is only 350µA per amplifier, a new output stage design sources and sinks in excess of 20mA of load current, while retaining high voltage gain.
U205-U208 U305 = ic:AD620
U209 U210 U306 U307 = ic:LTC1865L: The LTC®1864L/LTC1865L are 16-bit A/D converters that are offered in MSOP and SO-8 packages and operate on a single 3V supply. At 150ksps, the supply current is only 450µA. The supply current drops at lower speeds because the LTC1864L/LTC1865L automatically power down between conversions. These 16-bit switched capacitor successive approximation ADCs include sample-and-holds. The LTC1864L has a differential analog input with an external reference pin. The LTC1865L offers a softwareselectable 2-channel MUX and an external reference pin on the MSOP version. The 3-wire, serial I/O, small MSOP or SO-8 package and extremely high sample rate-to-power ratio make these ADCs ideal choices for compact, low power, high speed systems
U301 = ic:MAX743
U302 = ic:LP2985
U303 U304 = ic:LM50
U401-U407 = ic:HCPL-063N
X301 = con-phoenix-762:GMSTBA4: PHOENIX; MF: FARNELL; MPN: 1757268; OC_FARNELL: 3705195; OC_NEWARK: 71C4163

## Net classes
0 default: drill 0.3 mm
1 DUT+: drill 0.3 mm, clearance 1.905 mm to class 0
2 DUT-: drill 0.3 mm, clearance 1.905 mm to class 1
3 VSENSE+: drill 0.3 mm, clearance 1.905 mm to class 0, clearance 1.905 mm to class 2
4 VSENSE-: drill 0.3 mm, clearance 1.905 mm to class 1, clearance 1.905 mm to class 3
5 default_iso: drill 0.3 mm, clearance 1.905 mm to class 0, clearance 1.905 mm to class 1, clearance 1.905 mm to class 2, clearance 1.905 mm to class 3, clearance 1.905 mm to class 4

## Board
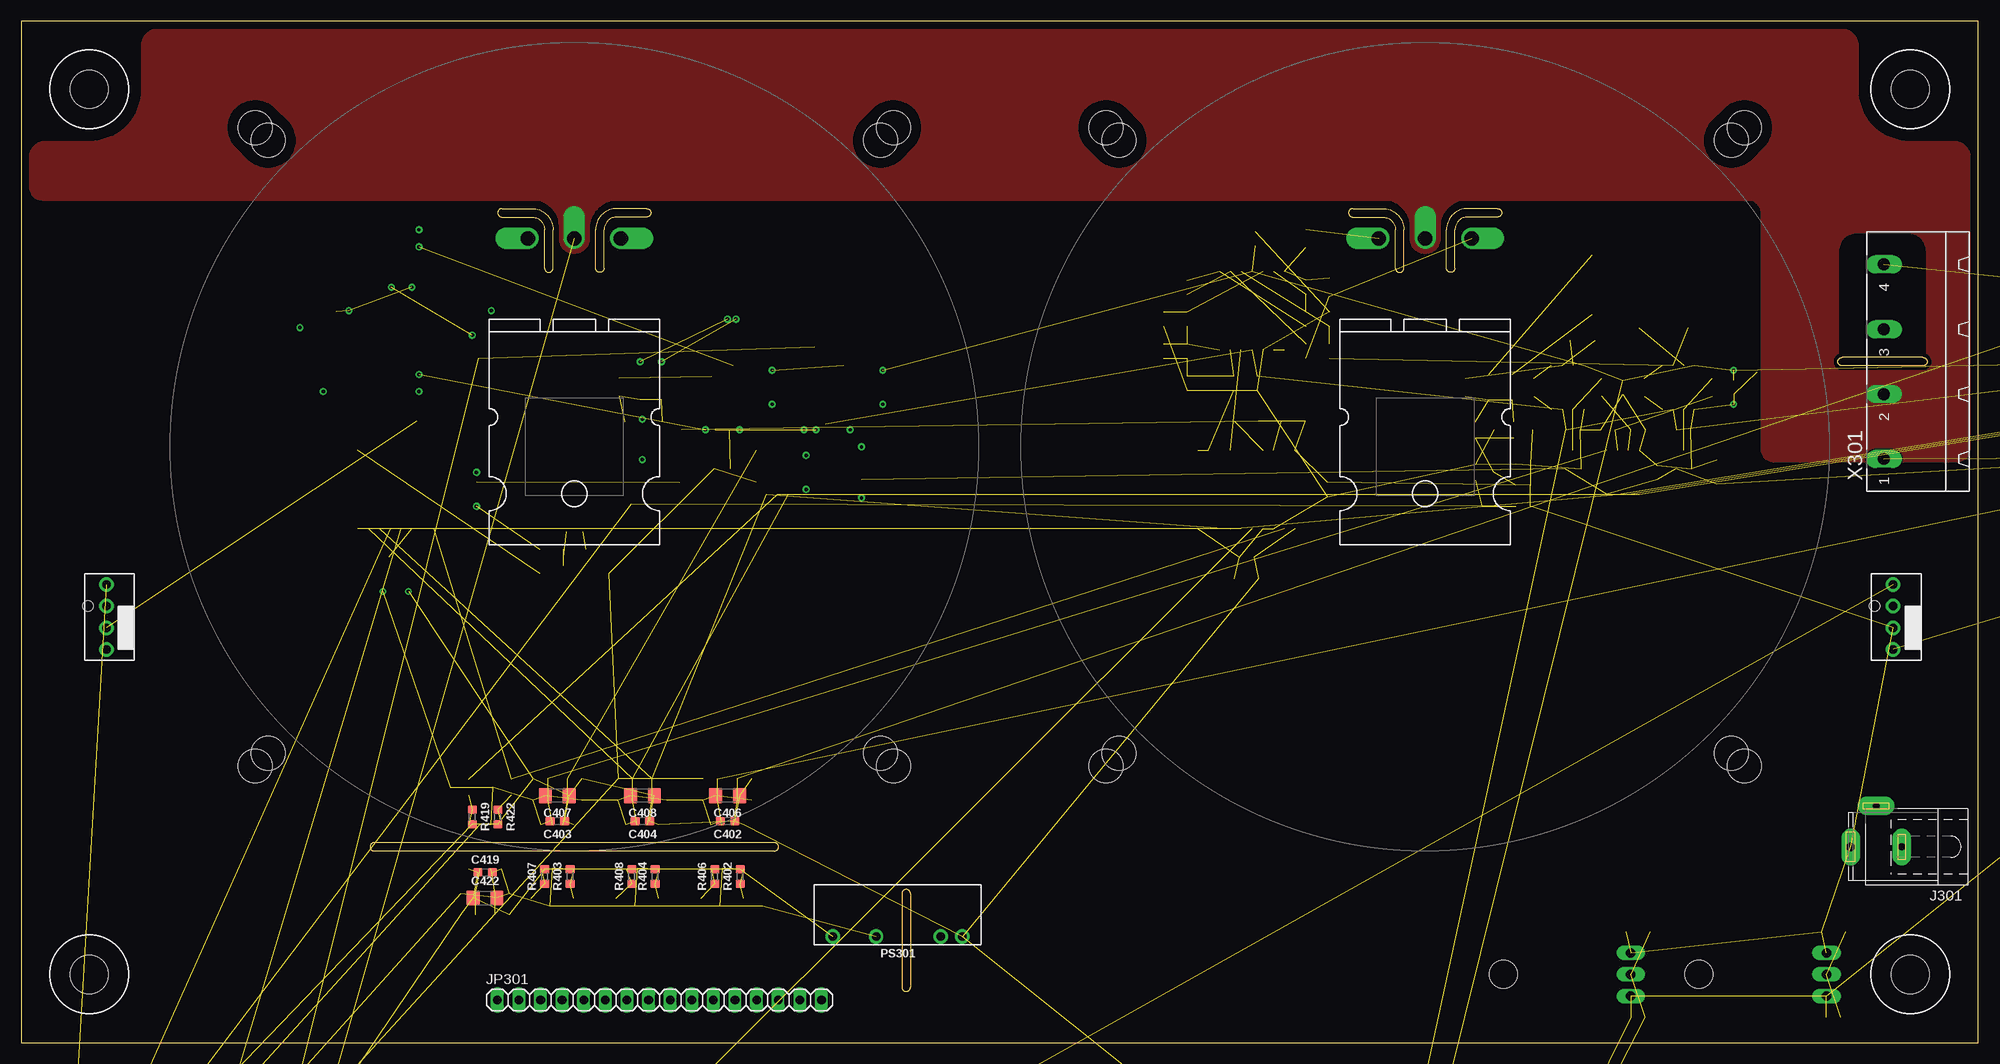
[diagram p4: board, top side]
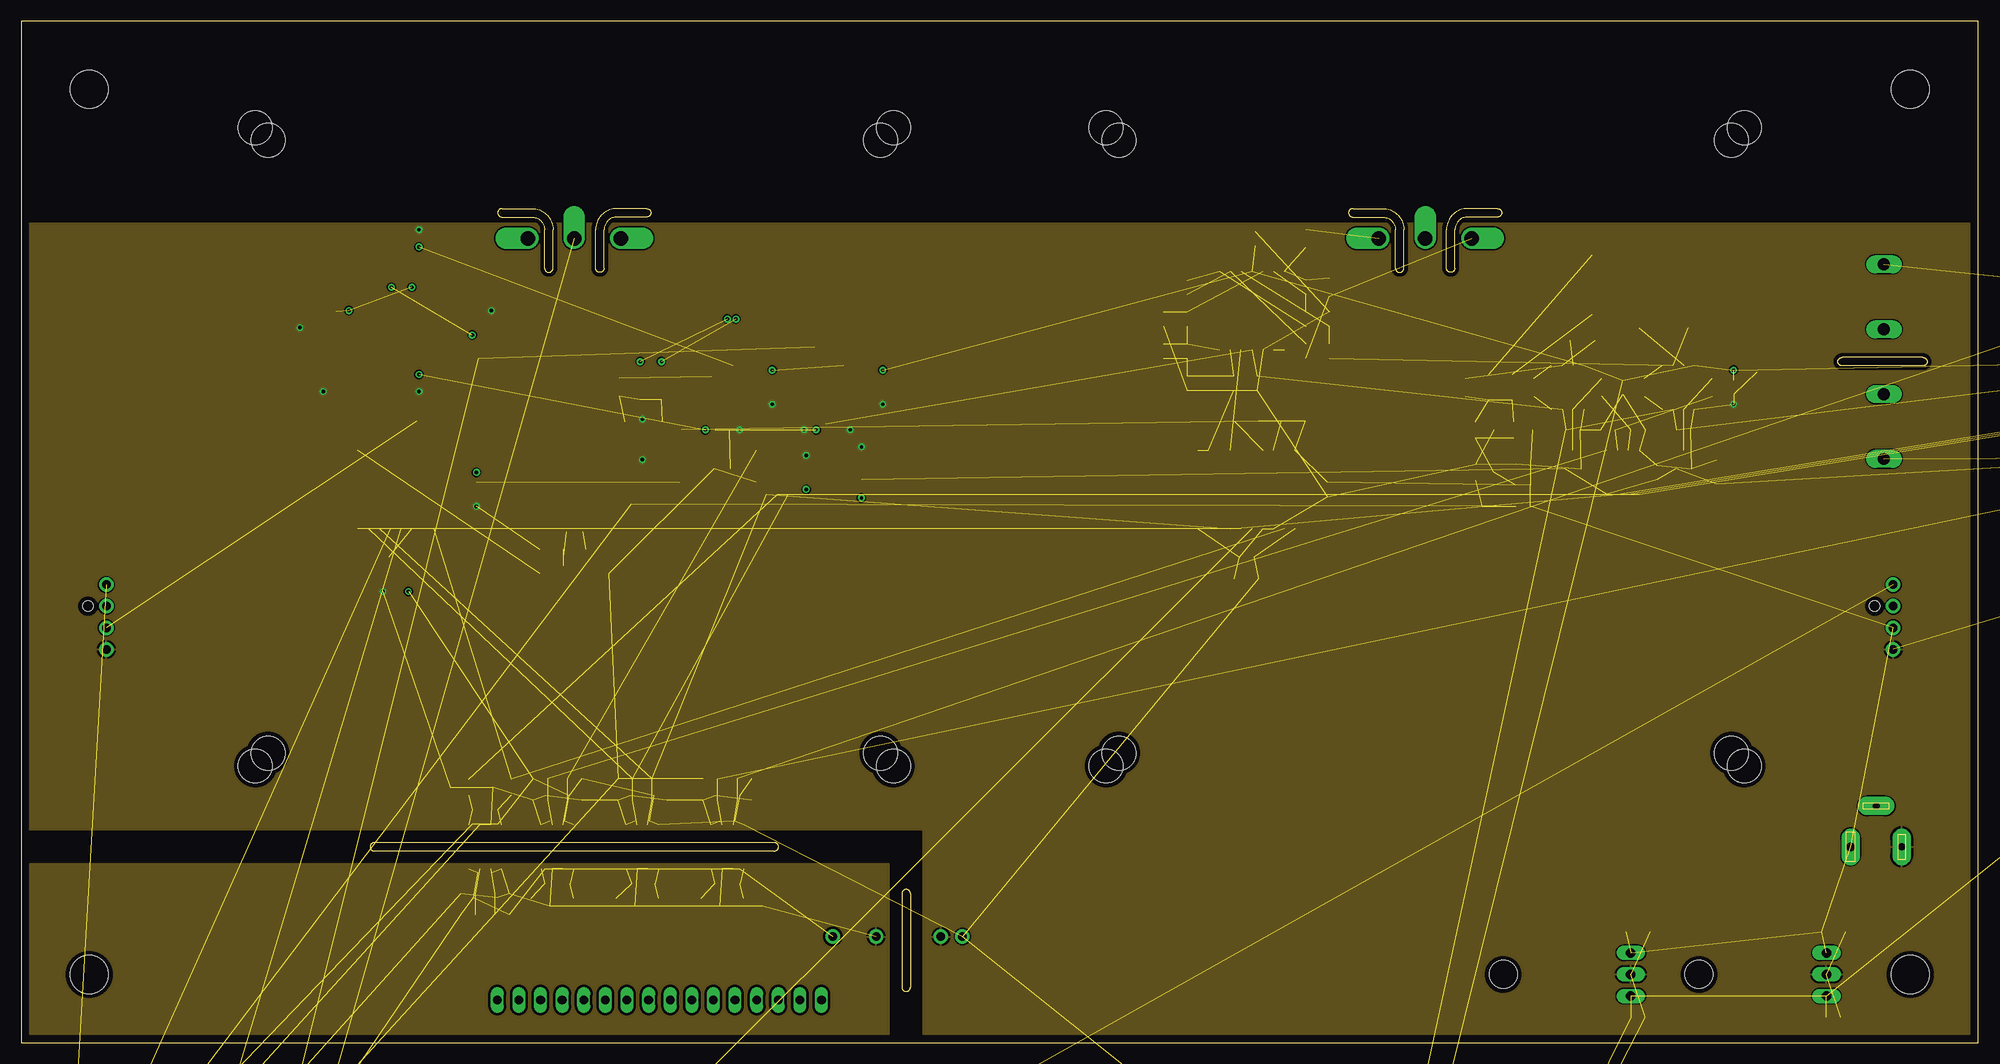
[diagram p5: board, inner layer Route15]
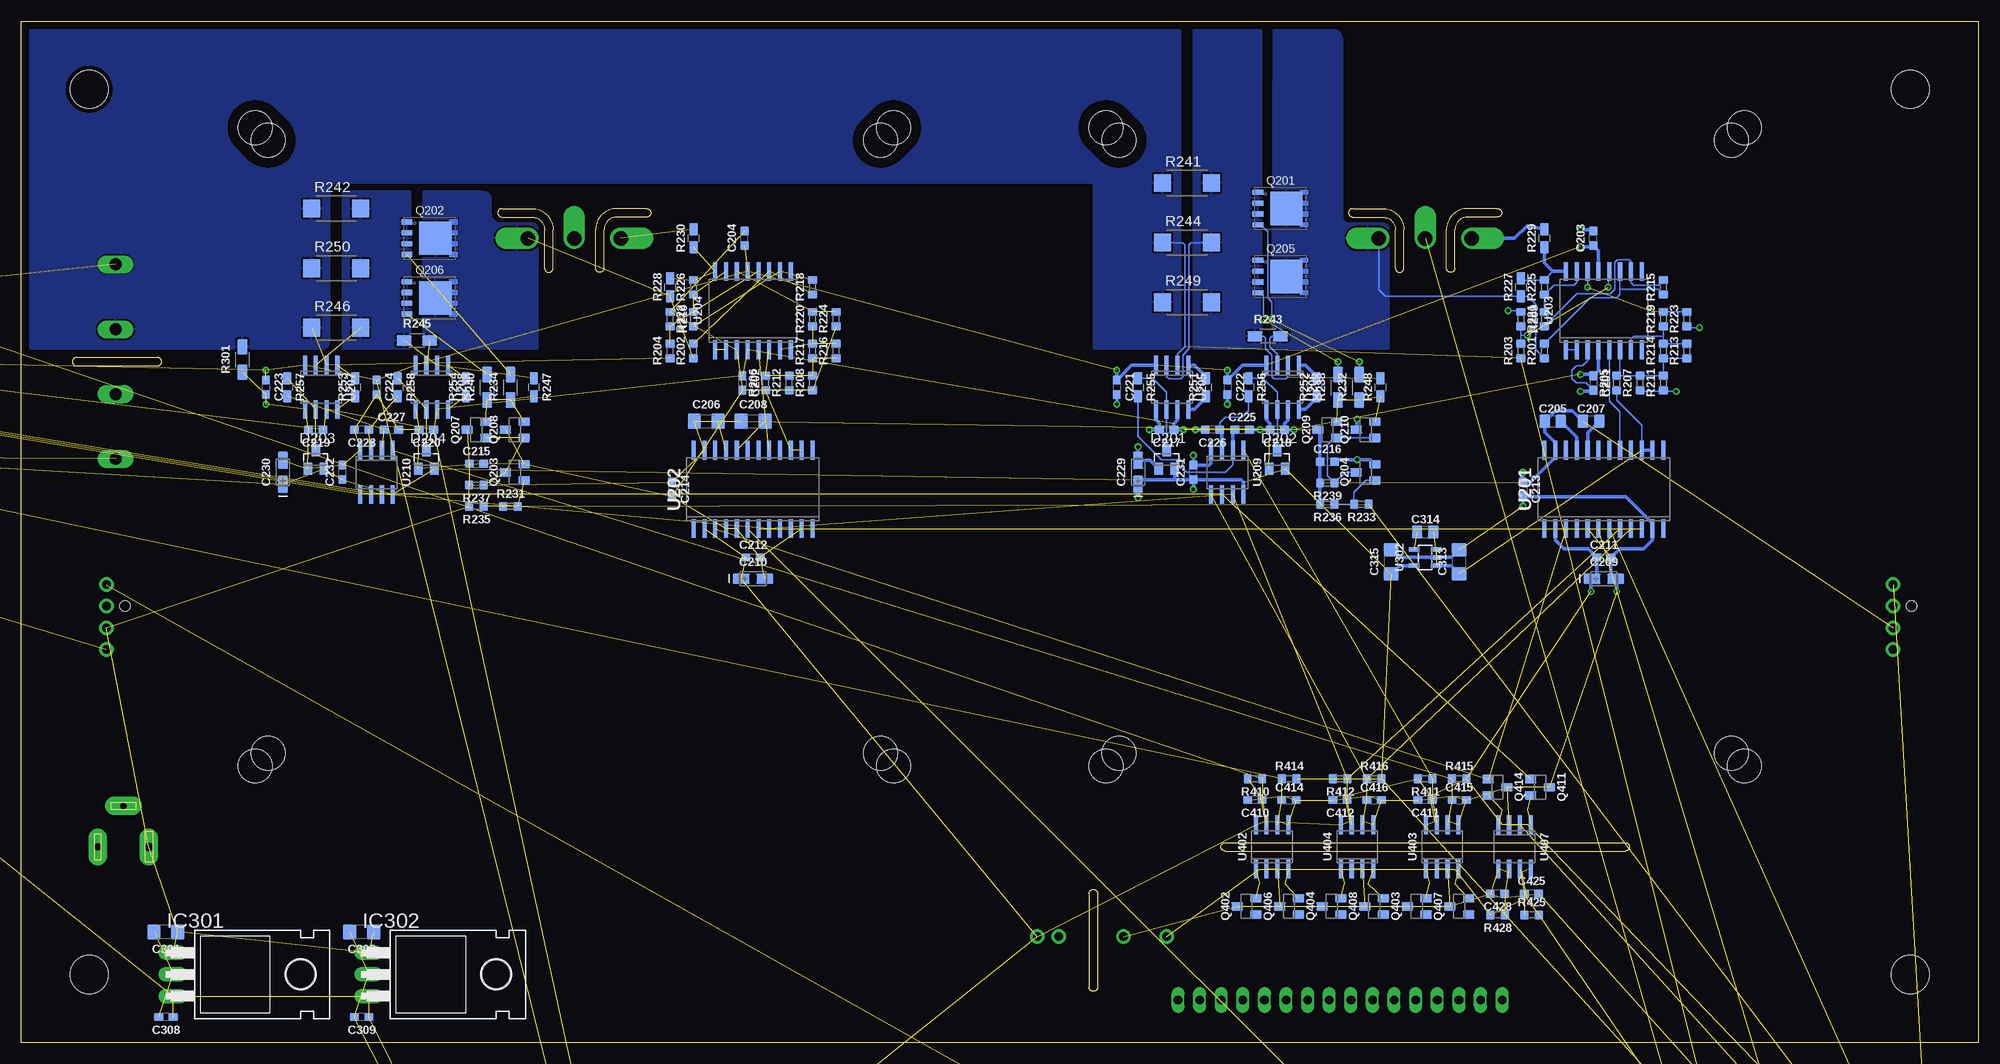
[diagram p6: board, bottom side, seen from below]

Size 230 x 120 mm. Coordinates in mm from the lower left corner, seen from the top.
Outline: 230,120 0,120 0,0 230,0 230,120
Outline: 223.5,79.5 214,79.5 arc-180 214,80.5 223.5,80.5 arc-180 223.5,79.5
Outline: 88.5,23.5 41.5,23.5 arc180 41.5,22.5 88.5,22.5 arc180 88.5,23.5
Outline: 168.5,91 168.5,95.5 arc-90 170,97 173.5,97 arc180 173.5,98 170,98 arc90 167.5,95.5 167.5,91 arc180 168.5,91
Outline: 161.5,91 161.5,95.5 arc90 160,97 156.5,97 arc-180 156.5,98 160,98 arc-90 162.5,95.5 162.5,91 arc-180 161.5,91
Outline: 68.5,91 68.5,95.5 arc-90 70,97 73.5,97 arc180 73.5,98 70,98 arc90 67.5,95.5 67.5,91 arc180 68.5,91
Outline: 61.5,91 61.5,95.5 arc90 60,97 56.5,97 arc-180 56.5,98 60,98 arc-90 62.5,95.5 62.5,91 arc-180 61.5,91
Outline: 104.5,17.5 104.5,6.5 arc-180 103.5,6.5 103.5,17.5 arc-180 104.5,17.5
Copper layers (1+2*15+16): Top 0.035mm / dielectric 0.18mm / Route2 0.017mm / dielectric 1.12mm / Route15 0.017mm / dielectric 0.18mm / Bottom 0.035mm
Design rules "JLCPCB 4 layers 1oz *": minimum track width 6mil, minimum drill 0.35mm, track to track 6mil, track to pad 6mil, pad to pad 6mil, via to via 6mil, smd to smd 6mil, copper to edge 0.5mm, drill to drill 6mil, minimum pad ring 10mil, minimum via ring 8mil, stop-mask expansion 4mil, vias tented up to drill 0mil, thermal gap 10mil
tRestrict: area 214,104 to 232,122; area -2,104 to 16,122; area 213.8,80 to 223.8,95; area 24.3,102.8 to 32.2,110.7; area 124.3,102.8 to 132.2,110.7; area 97.8,102.8 to 105.7,110.7; area 197.8,102.8 to 205.7,110.7; area 97.8,29.3 to 105.7,37.2; area 197.8,29.3 to 205.7,37.2; area 124.3,29.3 to 132.2,37.2; area 24.3,29.3 to 32.2,37.2
bRestrict: area 24.3,102.8 to 32.2,110.7; area 124.3,102.8 to 132.2,110.7; area 97.8,102.8 to 105.7,110.7; area 197.8,102.8 to 205.7,110.7; area 97.8,29.3 to 105.7,37.2; area 197.8,29.3 to 205.7,37.2; area 124.3,29.3 to 132.2,37.2; area 24.3,29.3 to 32.2,37.2

### Footprints (pad centres in the part's own frame; a part is rotated, then mirrored left to right if it is on the bottom)
C1608 = smd 1.1 x 1: 1 -0.85,0; 2 0.85,0
C2012 = smd 1.3 x 1.5: 1 -0.95,0; 2 0.95,0
C3216 = smd 1.6 x 1.8: 1 -1.4,0; 2 1.4,0
CT3216 = smd 2 x 1.2: + -1.4,0; - 1.4,0
CT6032 = smd 2.6 x 2.2: + -2.5,0; - 2.5,0
E3,5-10 = drill 0.813 pad 1.6: + -1.778,0 | drill 0.813 pad 1.6 octagon: - 1.778,0
C050-030X075 = drill 0.813 octagon: 1 -2.54,0; 2 2.54,0
SOT23 = smd 1 x 1.4: 1 -0.95,-1.1; 2 0.95,-1.1; 3 0,1.1
DO41-7.6 = drill 1.1 pad 1.7: A 3.81,0; C -3.81,0
HEATSINK-LGA115X = hole 4: -37.5,37.5; 37.5,37.5; 37.5,-37.5; -37.5,-37.5; -36,-36; 36,-36; 36,36; -36,36
TO220H = drill 1.118 long: 1 -2.54,-10.16; 2 0,-10.16; 3 2.54,-10.16 | hole 3.302: 0,4.826
SPC4078 = drill 0.8 pad 2.184 long: 1 -3,0; 2 0,-4.8 | drill 1 pad 2.184 long: 3 3,0
MOLEX_47053-1000 = drill 1 pad 1.7: 1 3.81,0; 2 1.27,0; 3 -1.27,0; 4 -3.81,0 | hole 1.25: -1.27,-2.16
1X16 = drill 1.016 long: 1 -19.05,0; 2 -16.51,0; 3 -13.97,0; 4 -11.43,0; 5 -8.89,0; 6 -6.35,0; 7 -3.81,0; 8 -1.27,0; 9 1.27,0; 10 3.81,0; 11 6.35,0; 12 8.89,0; 13 11.43,0; 14 13.97,0; 15 16.51,0; 16 19.05,0
MSS1260 = smd 5.5 x 4: 1 0,4.25; 2 0,-4.25
R3225W = smd 1.8 x 1.8: 1 -1.499,0; 2 1.499,0
RECOM-SIP7 = drill 1 pad 1.7: 1 -7.62,2.54; 2 -5.08,2.54; 5 2.54,2.54; 7 7.62,2.54
POWERPAK-SO-8 = smd 1.27 x 0.61: 1 -2.67,1.905; 2 -2.67,0.635; 3 -2.67,-0.635; 4 -2.67,-1.905 | smd 3.81 x 3.91: 5 0.69,0
TO-264P-H-PADUP = drill 1.7 pad 2.4 offset: 1 -5.46,0; 2 0,0; 3 5.46,0
R1608 = smd 1 x 1.1: 1 -0.85,0; 2 0.85,0
R2012W = smd 1.5 x 1: 1 -1.052,0; 2 1.052,0
R3216W = smd 1.8 x 1.2: 1 -1.499,0; 2 1.499,0
R6332W = smd 2 x 2.1: 1 -2.896,0; 2 2.896,0
0204/7 = drill 0.813 octagon: 1 -3.81,0; 2 3.81,0
SO24W = smd 0.6 x 2.2: 1 -6.985,-4.6; 2 -5.715,-4.6; 3 -4.445,-4.6; 4 -3.175,-4.6; 5 -1.905,-4.6; 6 -0.635,-4.6; 7 0.635,-4.6; 8 1.905,-4.6; 9 3.175,-4.6; 10 4.445,-4.6; 11 5.715,-4.6; 12 6.985,-4.6; 13 6.985,4.6; 14 5.715,4.6; 15 4.445,4.6; 16 3.175,4.6; 17 1.905,4.6; 18 0.635,4.6; 19 -0.635,4.6; 20 -1.905,4.6; 21 -3.175,4.6; 22 -4.445,4.6; 23 -5.715,4.6; 24 -6.985,4.6
SO16W = smd 0.6 x 2.2: 1 -4.445,-4.6; 2 -3.175,-4.6; 3 -1.905,-4.6; 4 -0.635,-4.6; 5 0.635,-4.6; 6 1.905,-4.6; 7 3.175,-4.6; 8 4.445,-4.6; 9 4.445,4.6; 10 3.175,4.6; 11 1.905,4.6; 12 0.635,4.6; 13 -0.635,4.6; 14 -1.905,4.6; 15 -3.175,4.6; 16 -4.445,4.6
SO8 = smd 0.6 x 2.2: 1 -1.905,-2.6; 2 -0.635,-2.6; 3 0.635,-2.6; 4 1.905,-2.6; 5 1.905,2.6; 6 0.635,2.6; 7 -0.635,2.6; 8 -1.905,2.6
SOT23-5L = smd 0.55 x 1.2: 1 -0.95,-1.3; 2 0,-1.3; 3 0.95,-1.3; 4 0.95,1.3; 5 -0.95,1.3
SOT23W = smd 1 x 1.4: 1 -0.95,-1.303; 2 0.95,-1.303; 3 0,1.303
M4 = hole 4.5: 0,0
GMSTBA4 = drill 1.397 long: 1 -11.43,5.08; 2 -3.81,5.08; 3 3.81,5.08; 4 11.43,5.08

### Placement (x,y rotation side)
C201  45.25,77.5 270 bottom
C202  145.25,77.5 270 bottom
C203  45.25,94.5 90 bottom
C204  145,94.5 90 bottom
C205  50,73 0 bottom
C206  149.5,73 0 bottom
C207  45.5,73 0 bottom
C208  144,73 0 bottom
C209  44,54.5 0 bottom
C210  144,54.5 0 bottom
C211  44,57 0 bottom
C212  144,57 0 bottom
C213  53.5,65 270 bottom
C214  153.5,65 270 bottom
C215  176.5,68 0 bottom
C216  76.5,68.25 0 bottom
C217  95.39,72 180 bottom
C218  82.38,72 180 bottom
C219  195.38,72 180 bottom
C220  182.38,72 180 bottom
C221  101.25,77 270 bottom
C222  88.25,77 270 bottom
C223  201.25,77 270 bottom
C224  188.25,77 270 bottom
C225  86.5,72 0 bottom
C226  90,72 180 bottom
C227  186.5,72 0 bottom
C228  190,72 180 bottom
C229  98.75,67 90 bottom
C230  199.25,67 90 bottom
C231  92.25,67 90 bottom
C232  192.25,67 90 bottom
C301  213,13 180 bottom
C302  190,13 180 bottom
C303  175,-28.5 0 bottom  (outside the outline)
C304  175,-31.5 180 bottom  (outside the outline)
C305  175,-26 0 bottom  (outside the outline)
C306  175,-38 180 bottom  (outside the outline)
C307  175,-34.5 180 bottom  (outside the outline)
C308  213,3 180 bottom
C309  190,3 180 bottom
C310  153,-30 0 bottom  (outside the outline)
C311  141,-24 90 bottom  (outside the outline)
C312  141,-36 90 bottom  (outside the outline)
C313  61,56.5 90 bottom
C314  65,60 0 bottom
C315  69,56.5 90 bottom
C316  364.5,116 90 bottom  (outside the outline)
C317  351.5,116 90 bottom  (outside the outline)
C318  357,116 90 bottom  (outside the outline)
C319  344,116 90 bottom  (outside the outline)
C320  3,-113 0 top  (outside the outline)
C321  336,118 270 bottom  (outside the outline)
C322  333,118 270 bottom  (outside the outline)
C323  318,63 0 top  (outside the outline)
C324  324,57 0 top  (outside the outline)
C325  323,63 0 top  (outside the outline)
C326  331,77 0 top  (outside the outline)
C327  328,63 0 top  (outside the outline)
C401  14,-45 0 top  (outside the outline)
C402  83,26 180 top
C403  63,26 180 top
C404  73,26 180 top
C405  6,-39 0 top  (outside the outline)
C406  83,29 180 top
C407  63,29 180 top
C408  73,29 180 top
C409  0,-50 0 top  (outside the outline)
C410  85,28.5 180 bottom
C411  65,28.5 180 bottom
C412  75,28.5 180 bottom
C413  4,-50 0 top  (outside the outline)
C414  81,28.5 0 bottom
C415  61,28.5 0 bottom
C416  71,28.5 0 bottom
C417  14,-71 0 top  (outside the outline)
C418  14,-97 0 top  (outside the outline)
C419  54.5,20 0 top
C420  6,-65 0 top  (outside the outline)
C421  6,-91 0 top  (outside the outline)
C422  54.5,17 0 top
C423  0,-76 0 top  (outside the outline)
C424  0,-102 0 top  (outside the outline)
C425  52.5,17.5 0 bottom
C426  4,-76 0 top  (outside the outline)
C427  4,-102 0 top  (outside the outline)
C428  56.5,17.5 180 bottom
D201  95.39,68.5 0 bottom
D202  82.38,68.5 0 bottom
D203  195.38,68.5 0 bottom
D204  182.38,68.5 0 bottom
D301  153,-26 180 bottom  (outside the outline)
D302  153,-34 0 bottom  (outside the outline)
D303  306,73 0 top  (outside the outline)
HS201  65,70 0 top
HS202  165,70 0 top
IC301  202,8 270 bottom
IC302  179,8 270 bottom
J301  218,23 180 top
J302  220,50 270 top
J303  10,50 270 top
JP301  75,5 0 top
L301  153,-42 90 bottom  (outside the outline)
L302  153,-18 270 bottom  (outside the outline)
MOV301  332,85 0 top  (outside the outline)
MOV302  313,76 0 top  (outside the outline)
MOV303  319,76 0 top  (outside the outline)
MOV304  325,76 0 top  (outside the outline)
PS301  103,15 180 top
Q201  82,98 0 bottom
Q202  182,94.5 0 bottom
Q203  172,67 90 bottom
Q204  72,67 90 bottom
Q205  82,90 0 bottom
Q206  182,87.5 0 bottom
Q207  176.5,72 90 bottom
Q208  172,72 90 bottom
Q209  76.5,72 90 bottom
Q210  72,72 90 bottom
Q211  65,94.5 180 top
Q212  165,94.5 180 top
Q401  10,-30 0 top  (outside the outline)
Q402  86,16 90 bottom
Q403  66,16 90 bottom
Q404  76,16 90 bottom
Q405  1,-39 0 top  (outside the outline)
Q406  81,16 90 bottom
Q407  61,16 90 bottom
Q408  71,16 90 bottom
Q409  10,-56 0 top  (outside the outline)
Q410  10,-82 0 top  (outside the outline)
Q411  51.5,30 270 bottom
Q412  1,-65 0 top  (outside the outline)
Q413  1,-91 0 top  (outside the outline)
Q414  56.5,30 270 bottom
R201  51,81.25 90 bottom
R202  151,81.25 90 bottom
R203  53.75,81.25 90 bottom
R204  153.75,81.25 90 bottom
R205  42.5,77.5 90 bottom
R206  142.5,77.5 90 bottom
R207  39.75,77.5 90 bottom
R208  137,77.5 90 bottom
R209  53.75,85 270 bottom
R210  153.75,85 270 bottom
R211  37,77.5 90 bottom
R212  139.75,77.5 90 bottom
R213  34.25,81.25 90 bottom
R214  37,81.25 90 bottom
R215  37,88.75 90 bottom
R216  134.25,81.25 90 bottom
R217  137,81.25 90 bottom
R218  137,88.75 90 bottom
R219  37,85 90 bottom
R220  137,85 90 bottom
R221  51,85 90 bottom
R222  151,85 90 bottom
R223  34.25,85 90 bottom
R224  134.25,85 90 bottom
R225  51,88.75 90 bottom
R226  151,88.75 90 bottom
R227  53.75,88.75 90 bottom
R228  153.75,88.75 90 bottom
R229  51,94.5 90 bottom
R230  151,94.5 90 bottom
R231  172.5,63 0 bottom
R232  72.75,77 90 bottom
R233  72.5,63.25 180 bottom
R234  172.5,77 90 bottom
R235  176.5,63 180 bottom
R236  76.5,63.25 180 bottom
R237  176.5,65.5 180 bottom
R238  75.25,77 90 bottom
R239  76.5,65.75 180 bottom
R240  175.25,77 90 bottom
R241  93,101 0 bottom
R242  193,98 0 bottom
R243  83.5,83 0 bottom
R244  93,94 0 bottom
R245  183.5,82.5 0 bottom
R246  193,84 0 bottom
R247  169.75,77 270 bottom
R248  70.25,77 90 bottom
R249  93,87 0 bottom
R250  193,91 0 bottom
R251  90.75,77 90 bottom
R252  77.75,77 90 bottom
R253  190.75,77 90 bottom
R254  177.75,77 90 bottom
R255  98.75,77 270 bottom
R256  85.75,77 270 bottom
R257  198.75,77 270 bottom
R258  185.75,77 270 bottom
R301  204,80.25 90 bottom
R302  313,69 0 top  (outside the outline)
R303  3,-109 0 top  (outside the outline)
R304  319,69 0 top  (outside the outline)
R305  325,69 0 top  (outside the outline)
R306  331,69 0 top  (outside the outline)
R307  313,63 0 top  (outside the outline)
R308  312,57 0 top  (outside the outline)
R309  316,57 0 top  (outside the outline)
R310  333,63 0 top  (outside the outline)
R311  320,57 0 top  (outside the outline)
R401  5,-45 0 top  (outside the outline)
R402  84.5,19.5 90 top
R403  64.5,19.5 90 top
R404  74.5,19.5 90 top
R405  10,-45 0 top  (outside the outline)
R406  81.5,19.5 90 top
R407  61.5,19.5 90 top
R408  71.75,19.5 90 top
R409  11,-38 0 top  (outside the outline)
R410  85,31 180 bottom
R411  65,31 180 bottom
R412  75,31 180 bottom
R413  0,-45 0 top  (outside the outline)
R414  81,31 0 bottom
R415  61,31 0 bottom
R416  71,31 0 bottom
R417  5,-71 0 top  (outside the outline)
R418  5,-97 0 top  (outside the outline)
R419  53,26.5 270 top
R420  10,-71 0 top  (outside the outline)
R421  10,-97 0 top  (outside the outline)
R422  56,26.5 270 top
R423  11,-64 0 top  (outside the outline)
R424  11,-90 0 top  (outside the outline)
R425  52.5,15 0 bottom
R426  0,-71 0 top  (outside the outline)
R427  0,-97 0 top  (outside the outline)
R428  56.5,15 180 bottom
U201  44,65 0 bottom
U202  144,65 0 bottom
U203  44,86 0 bottom
U204  144,86 0 bottom
U205  94.75,77 180 bottom
U206  81.75,77 180 bottom
U207  194.75,77 180 bottom
U208  181.75,77 180 bottom
U209  88.25,67 180 bottom
U210  188.25,67 180 bottom
U301  165,-30 270 bottom  (outside the outline)
U302  65,57 90 bottom
U303  361,116 0 bottom  (outside the outline)
U304  348,116 0 bottom  (outside the outline)
U305  315,84 0 top  (outside the outline)
U306  329,118 0 bottom  (outside the outline)
U307  324,84 0 top  (outside the outline)
U401  3,-31 0 top  (outside the outline)
U402  83,23 0 bottom
U403  63,23 0 bottom
U404  73,23 0 bottom
U405  3,-57 0 top  (outside the outline)
U406  3,-83 0 top  (outside the outline)
U407  54.5,23 180 bottom
U$6  [M4]  8,112 0 top
U$7  [M4]  222,112 0 top
U$8  [M4]  222,8 0 top
U$9  [M4]  8,8 0 top
X301  224,80 90 top

### Tracks (layer width: path | path; a pad name or v marks a point on that pad's centre or on a via)
+3V3  (via drill 0.4)  (20 unrouted)
  Bottom 0.406: U209.8 86.34,65.84 86.65,66.15 C231.1 | v92.25,65 C231.1 | C231.1 94.44,66.15 | 94.44,66.15 95,66.15 98.75,66.15 C229.+ v98.75,64 | D201.2 94.44,66.15 | U302.5 68.05,56.05 C315.1
+5V  (via drill 0.4)  (46 unrouted)
  Bottom 0.406: U201.2 49.72,59 48.72,58 45.85,58 C211.1 | 45,56.85 C211.1 | C211.1 44.85,55.05 C209.+ 45.5,54.4 v45.5,53
+5V_I  (17 unrouted)
+12V  (via drill 0.4)  (16 unrouted)
  Bottom 0.406: R236.2 R239.2 C216.1 77.35,71.75 Q209.3 | C207.1 47.7,74.25 49.7,74.25 C205.1 50.95,71.7 49.72,70.47 U201.23 49.72,68.78 52.65,65.85 C213.1 v53.5,67
+15V  (via drill 0.4)  (13 unrouted)
  Bottom 0.406: U206.7 81.12,73.14 81.53,72.72 C218.1 v80.41,72 | U205.7 94.11,73.14 94.53,72.72 C217.1 v93.41,72 | U203.4 44.64,78.97 C201.1 45.4,78.5 v46.75,78.5
-15V  (via drill 0.4)  (14 unrouted)
  Bottom 0.406: v88.25,79 C222.1 86.5,79.6 U206.4 | v101.25,79 C221.1 99.5,79.6 U205.4 | U203.13 44.64,93.03 C203.1 45.4,93.5 v46.75,93.5
  other vias: 201.25,79
BPY1G1  (via drill 0.4)  (1 unrouted)
  Bottom 0.203: v83,85 83,87 83.5,87.5 83.5,95.25 84.34,96.09 Q201.4 | v72.75,80 R232.2
BYP  (4 unrouted)
BYP1  (4 unrouted)
BYP1G2  (via drill 0.4)  (1 unrouted)
  Bottom 0.203: Q205.4 84.34,88.09 84,87.75 v84,85 | v75.25,80 R238.2
BYP2  (4 unrouted)
BYP2G1  (1 unrouted)
BYP2G2  (1 unrouted)
CLR_DAC1  (3 unrouted)
CLR_DAC2  (3 unrouted)
CONV_C1  (3 unrouted)
CONV_C2  (3 unrouted)
CONV_TEMP  (3 unrouted)
CONV_V  (3 unrouted)
CSEN_H1  (1 unrouted)
  Bottom 0.203: 81.12,78.89 U206.2 81.12,78.25 81.37,78 82.77,78 83.02,78.25 83.02,80.77 83.75,81.5 83.75,82.75 84,83 R243.1 | U205.3 95.39,78.25 95.14,78 93.73,78 93.48,78.25 93.48,80.77 92.75,81.5 92.75,93.75 92.5,94 R244.2
  pour Bottom (rank 3): 84.25,81.5 92.25,81.5 92.25,119 84.25,119
CSEN_H2  (3 unrouted)
  pour Bottom (rank 3): 184.25,81.5 192.25,81.5 192.25,100 184.25,100
CSEN_L1
  Bottom 0.203: U206.3 82.38,80.89 83.25,81.75 83.25,82.75 83,83 R243.2 | R201.1 52,81.4 52,86.75 52.95,87.7 R227.1 69.7,87.7 70.46,88.46 Q211.1
  pour Bottom (rank 3): 69.25,95.5 arc-90 70,96.25 74,96.25 arc90 74.75,97 74.75,118 arc-90 75.75,119 82.81,119 83,82.5 arc-90 82.25,81.5 69.25,81.5
CSEN_L2  (3 unrouted)
  pour Bottom (rank 3): 169.25,95.5 arc-90 170,96.25 173.75,96.25 arc90 174.75,97.5 174.75,99 arc-90 175.75,100 182.75,100 182.75,82.5 arc-90 181.75,81.5 169.25,81.5
DAC_VOUT
  Bottom 0.203: U203.5 43.36,75.36 42.09,74.09 U201.17
DAC_VOUT1  (1 unrouted)
DUT+  (1 unrouted)
  pour Top (no thermals): 63.25,96 63.25,94.5 arc180 66.75,94.5 66.75,95.75 arc-90 70,99 160.25,99 arc-90 163.25,96 163.25,94.5 arc90 165,92.75 arc90 166.75,94.5 166.75,96 arc-90 169.75,99 203,99 arc-90 204.5,97.5 204.5,69.75 arc90 206,68.25 227.5,68.25 arc90 229,69.75 229,118.5 arc90 228.5,119 1.5,119 arc90 1,118.5 1,100.5 arc90 2.5,99 60.25,99 arc-90
DUT-  (4 unrouted)
  Bottom 0.203: U205.2 94.11,80.89 93.25,81.75 93.25,93.75 93.5,94 R244.1
  pour Bottom (rank 3): 193.75,82.5 arc90 194.75,81.5 205,81.5 205,101 193.75,101
  pour Bottom: 93.75,81.5 93.75,119 229,119 229,81.5 205,81.5 205,101 104,101 104,81.5
FAN1_PWM  (3 unrouted)
FAN2_PWM  (3 unrouted)
FLT_DAC  (2 unrouted)
FLT_DAC_I  (2 unrouted)
GND  (via drill 0.4)  (104 unrouted)
  Bottom 0.203: v35.5,76.5 36.85,76.5 | 36.85,76.5 R211.1 | R207.1 39.6,76.5 36.85,76.5 | v32.75,84 34.1,84 R223.1 | U203.3 45.91,80.09 46.5,79.5 47.25,79.5 47.75,79 47.75,78 47.25,77.5 46.1,77.5 C201.2 | v55.25,86 53.9,86 R209.1
  Bottom 0.406: U206.5 83.66,73.16 83.23,72.73 C218.2 v84.41,72 C225.2 | U205.5 96.66,73.16 96.23,72.73 C217.2 v97.41,72 | v88.25,75 C222.2 | C221.2 v101.25,75 | C226.2 v92,72 | U209.4 90.16,68.09 90.4,67.85 C231.2 v92.25,69 | v98.75,70 C229.- 97.34,68.4 D201.1 | Q210.3 73,72.1 v73,73.25 | Q204.2 71.45,68.5 v73,68.5 75.4,68.5 C216.2 | C211.2 42.15,58 39.28,58 38.28,59 U201.11 38.28,61 41.44,64.15 C213.2 v53.5,63 | 43,56.85 C211.2 | C211.2 43.15,55.05 C209.- 42.5,54.4 v42.5,53 | C313.2 61.9,57 U302.2 68.1,57 C315.2 | C203.2 45.4,95.5 v46.75,95.5 | C201.2 45.4,76.5 v46.75,76.5
  other vias: 201.25,75
  pour Route15: 1,25 1,96.25 229,96.25 229,1 106,1 106,25
GNDI  (29 unrouted)
  pour Route15 (isolate 0.305): 1,1 1,21 102,21 102,1
HIGHC1
  Bottom 0.203: U209.2 87.61,67.89 88.5,67 93,67 93.5,67.5 93.5,68.25 93.75,68.5 96,68.5 98.75,71.25 R255.2
  Bottom 0.406: U209.2 87.61,71.73 C225.1
HIGHC2  (2 unrouted)
LATCH_DAC  (4 unrouted)
LGATE_1
  Bottom 0.406: Q211.3 55,94.5 54.5,94.5 53,96 R229.2
LGATE_2  (1 unrouted)
LOWC1
  Bottom 0.203: R256.2 85.75,74.25 86.5,73.5 88.5,73.5 89.15,72.85 C226.1
  Bottom 0.406: U209.3 88.89,71.73 C226.1
LOWC2  (2 unrouted)
MISO  (4 unrouted)
MISO_I  (2 unrouted)
MOSI  (7 unrouted)
N$1  (via drill 0.4)  (1 unrouted)
  Bottom 0.203: R203.2 53.75,83.12 | 53.75,83.12 R209.2 | v53,83.12 53.75,83.12 | v43.5,88.75 43.5,90.47 U203.12
N$2
  Bottom 0.203: U203.15 47.17,89.33 47.5,89 49.9,89 R225.1 R221.2
N$3
  Bottom 0.406: U201.21 47.17,71.12 C205.2
N$4
  Bottom 0.406: C207.2 45.91,71.64 U201.20
N$5
  Bottom 0.203: 75.7,71.05 76.5,70.25 76.5,66.6 R239.1 74.4,67 Q204.3 | Q209.1 Q210.1
  Bottom 0.254: 75.7,71.05 Q209.1
N$6
  Bottom 0.203: 50,90.6 R225.2 53.55,89.6 R227.2
  Bottom 0.406: U203.16 50,90.6 51,91.6 R229.1
N$7
  Bottom 0.203: D201.3 U205.6 95.39,76.39 97.05,78.05 R255.1
N$8
  Bottom 0.203: Q204.1 71.95,66.05 73.35,64.65 R233.2 R236.1
N$9  (via drill 0.4)  (2 unrouted)
  Bottom 0.203: R223.2 R219.2 | v45.91,88.75 U203.14
  other vias: 38.5,86
N$10  (1 unrouted)
N$11
  Bottom 0.203: R213.2 R214.2 37,83 | R219.1 37,83 | 37,83 40.5,83 40.83,82.67 U203.7
N$12
  Bottom 0.203: U203.6 42.09,78.75 R205.2 R207.2 R211.2 R214.1 R213.1
N$13
  Bottom 0.203: R215.2 37.6,89 40.5,89 40.83,89.33 U203.10 40.83,91.83 41,92 42.42,92 42.73,91.69 42.73,88.5 43.23,88 47.15,88 R221.1
N$14
  Bottom 0.203: R215.1 37.6,88.5 41,88.5 42.09,88.5 | R201.2 45.6,87.5 42.5,87.5 42.09,87.91 42.09,88.5 | U203.11 42.09,88.5
N$15
  Bottom 0.203: U203.2 U203.1
N$16
  Bottom 0.203: D202.3 82.38,74.5 U206.6 82.38,76.39 84.05,78.05 R256.1
N$17  (2 unrouted)
N$18  (2 unrouted)
N$19  (2 unrouted)
N$20  (2 unrouted)
N$21  (2 unrouted)
N$22  (2 unrouted)
N$23  (1 unrouted)
N$24  (1 unrouted)
N$25  (3 unrouted)
N$26  (1 unrouted)
N$27  (1 unrouted)
N$28  (1 unrouted)
N$29  (2 unrouted)
N$30  (3 unrouted)
N$31  (2 unrouted)
N$32  (1 unrouted)
N$33  (1 unrouted)
N$34  (1 unrouted)
N$35  (1 unrouted)
N$36  (1 unrouted)
N$37  (1 unrouted)
N$38  (2 unrouted)
N$39  (2 unrouted)
N$40  (2 unrouted)
N$41  (1 unrouted)
N$42  (1 unrouted)
N$43  (5 unrouted)
N$44  (2 unrouted)
N$45  (1 unrouted)
N$46  (2 unrouted)
N$47  (2 unrouted)
N$48  (2 unrouted)
N$49  (2 unrouted)
N$50  (2 unrouted)
N$51  (2 unrouted)
N$52  (3 unrouted)
N$53  (2 unrouted)
N$54  (3 unrouted)
N$55  (1 unrouted)
N$56  (2 unrouted)
N$57  (2 unrouted)
N$58  (2 unrouted)
N$59  (2 unrouted)
N$61  (1 unrouted)
N$76  (2 unrouted)
N$77  (2 unrouted)
RG1_H6  (1 unrouted)
RG1_L1  (1 unrouted)
RG1_L2  (1 unrouted)
RG1_L3
  Bottom 0.406: U205.1 92.1,79.6 90.75,78.25 R251.2
RG1_L4
  Bottom 0.406: U206.1 79.1,79.6 78,78.5 78,78.3 R252.2
RG2_H6  (1 unrouted)
RG2_L1  (1 unrouted)
RG2_L2  (1 unrouted)
RG2_L3
  Bottom 0.406: U205.8 92.1,74.4 90.75,75.75 R251.1
RG2_L4
  Bottom 0.406: U206.8 79.1,74.4 77.75,75.75 R252.1
SCK  (8 unrouted)
SDO_DAC1  (1 unrouted)
TEMP1  (2 unrouted)
TEMP2  (2 unrouted)
VREF1  (2 unrouted)
  Bottom 0.203: U201.15 39.56,72.56 42.5,75.5 R205.1
  Bottom 0.406: C313.1 61.95,56.05 U302.1 | U201.14 U201.15
VREF2  (2 unrouted)
VREF_MAX743  (1 unrouted)
VSENSE+  (2 unrouted)
VSENSE-  (2 unrouted)